# EasyEDA Pro project ProDoc_ESP32_V2_Plant Board_Abed_Double Sided_2025-12-05.epro

# Schematic Board Plant_1

## Sheets
1 Minsys: Board Name: ESP32_V2_Plant Board_Abed_Double Sided; Create Date: 2025-10-20; Page Name: Minsys; Project Name: Pjbl3_2025-2026; Schematic Name: Board Plant_1; Update Date: 2025-11-06; Company: EasyEDA.com; Page Size: A4; Version: V1.0
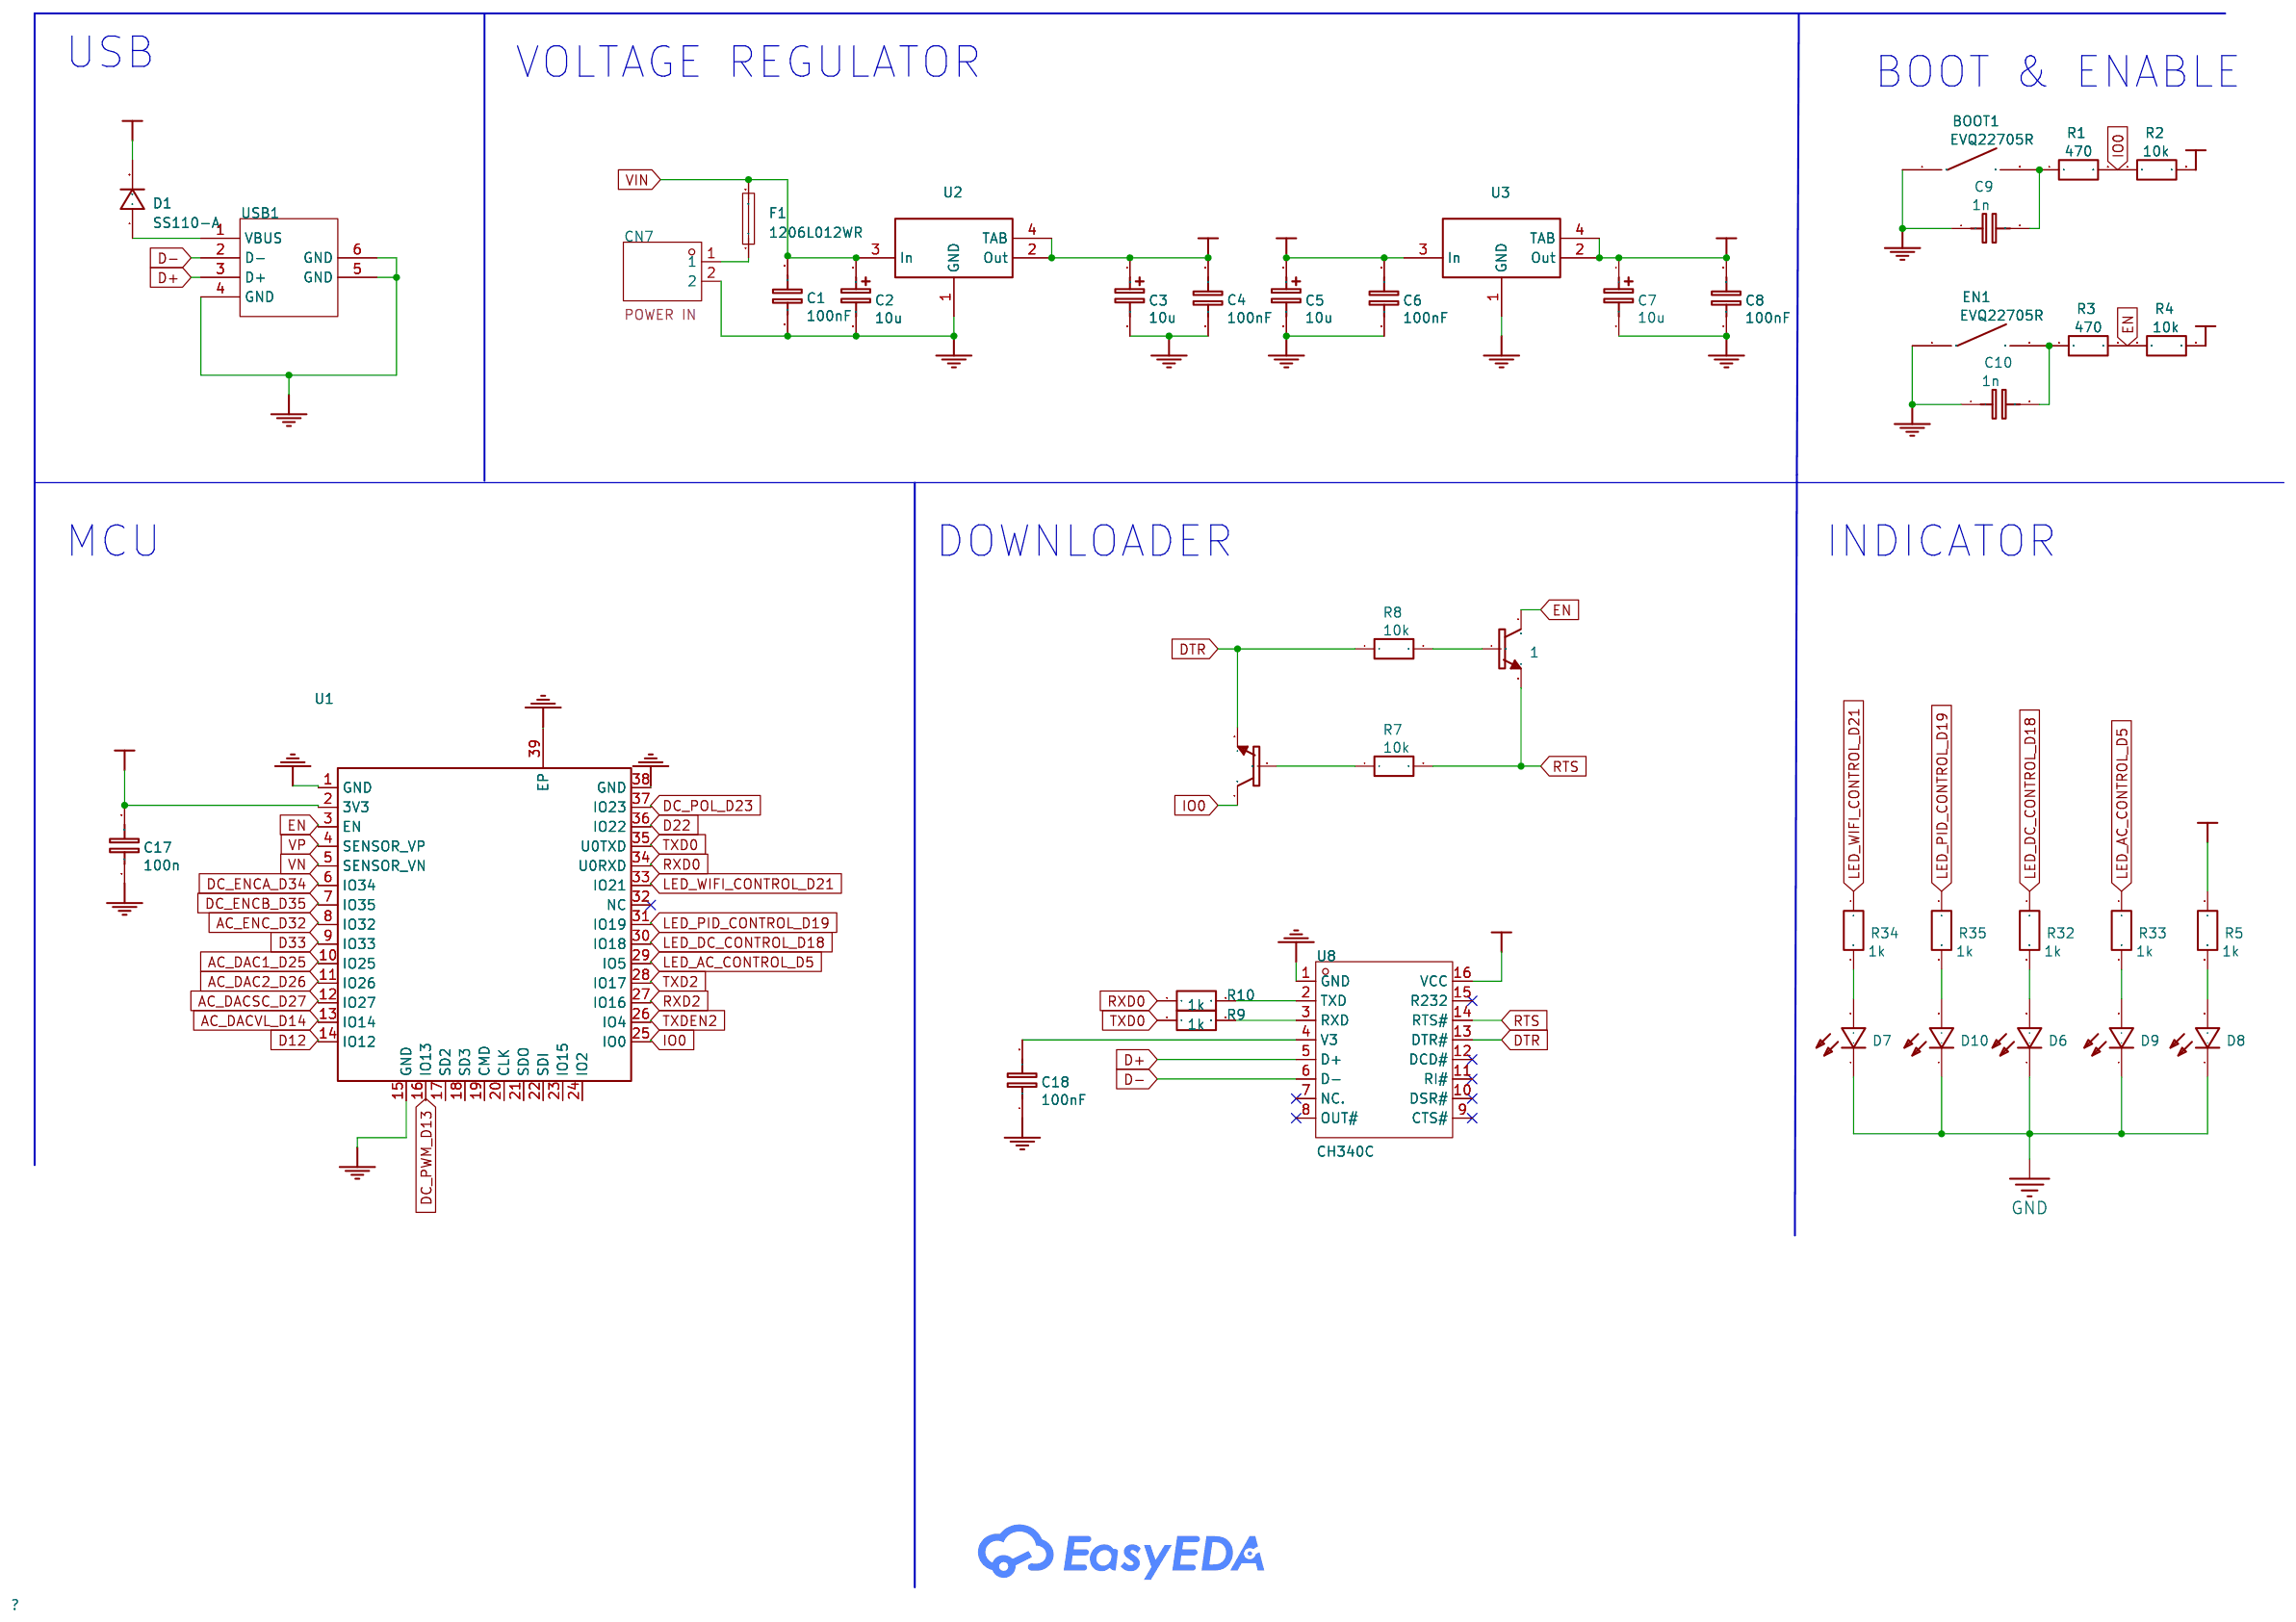
[diagram p0: Minsys]
2 DC Motor Control: Page Name: DC Motor Control; Company: Pjbl-3 2025/2026; Drawn: Pjbl 3-8
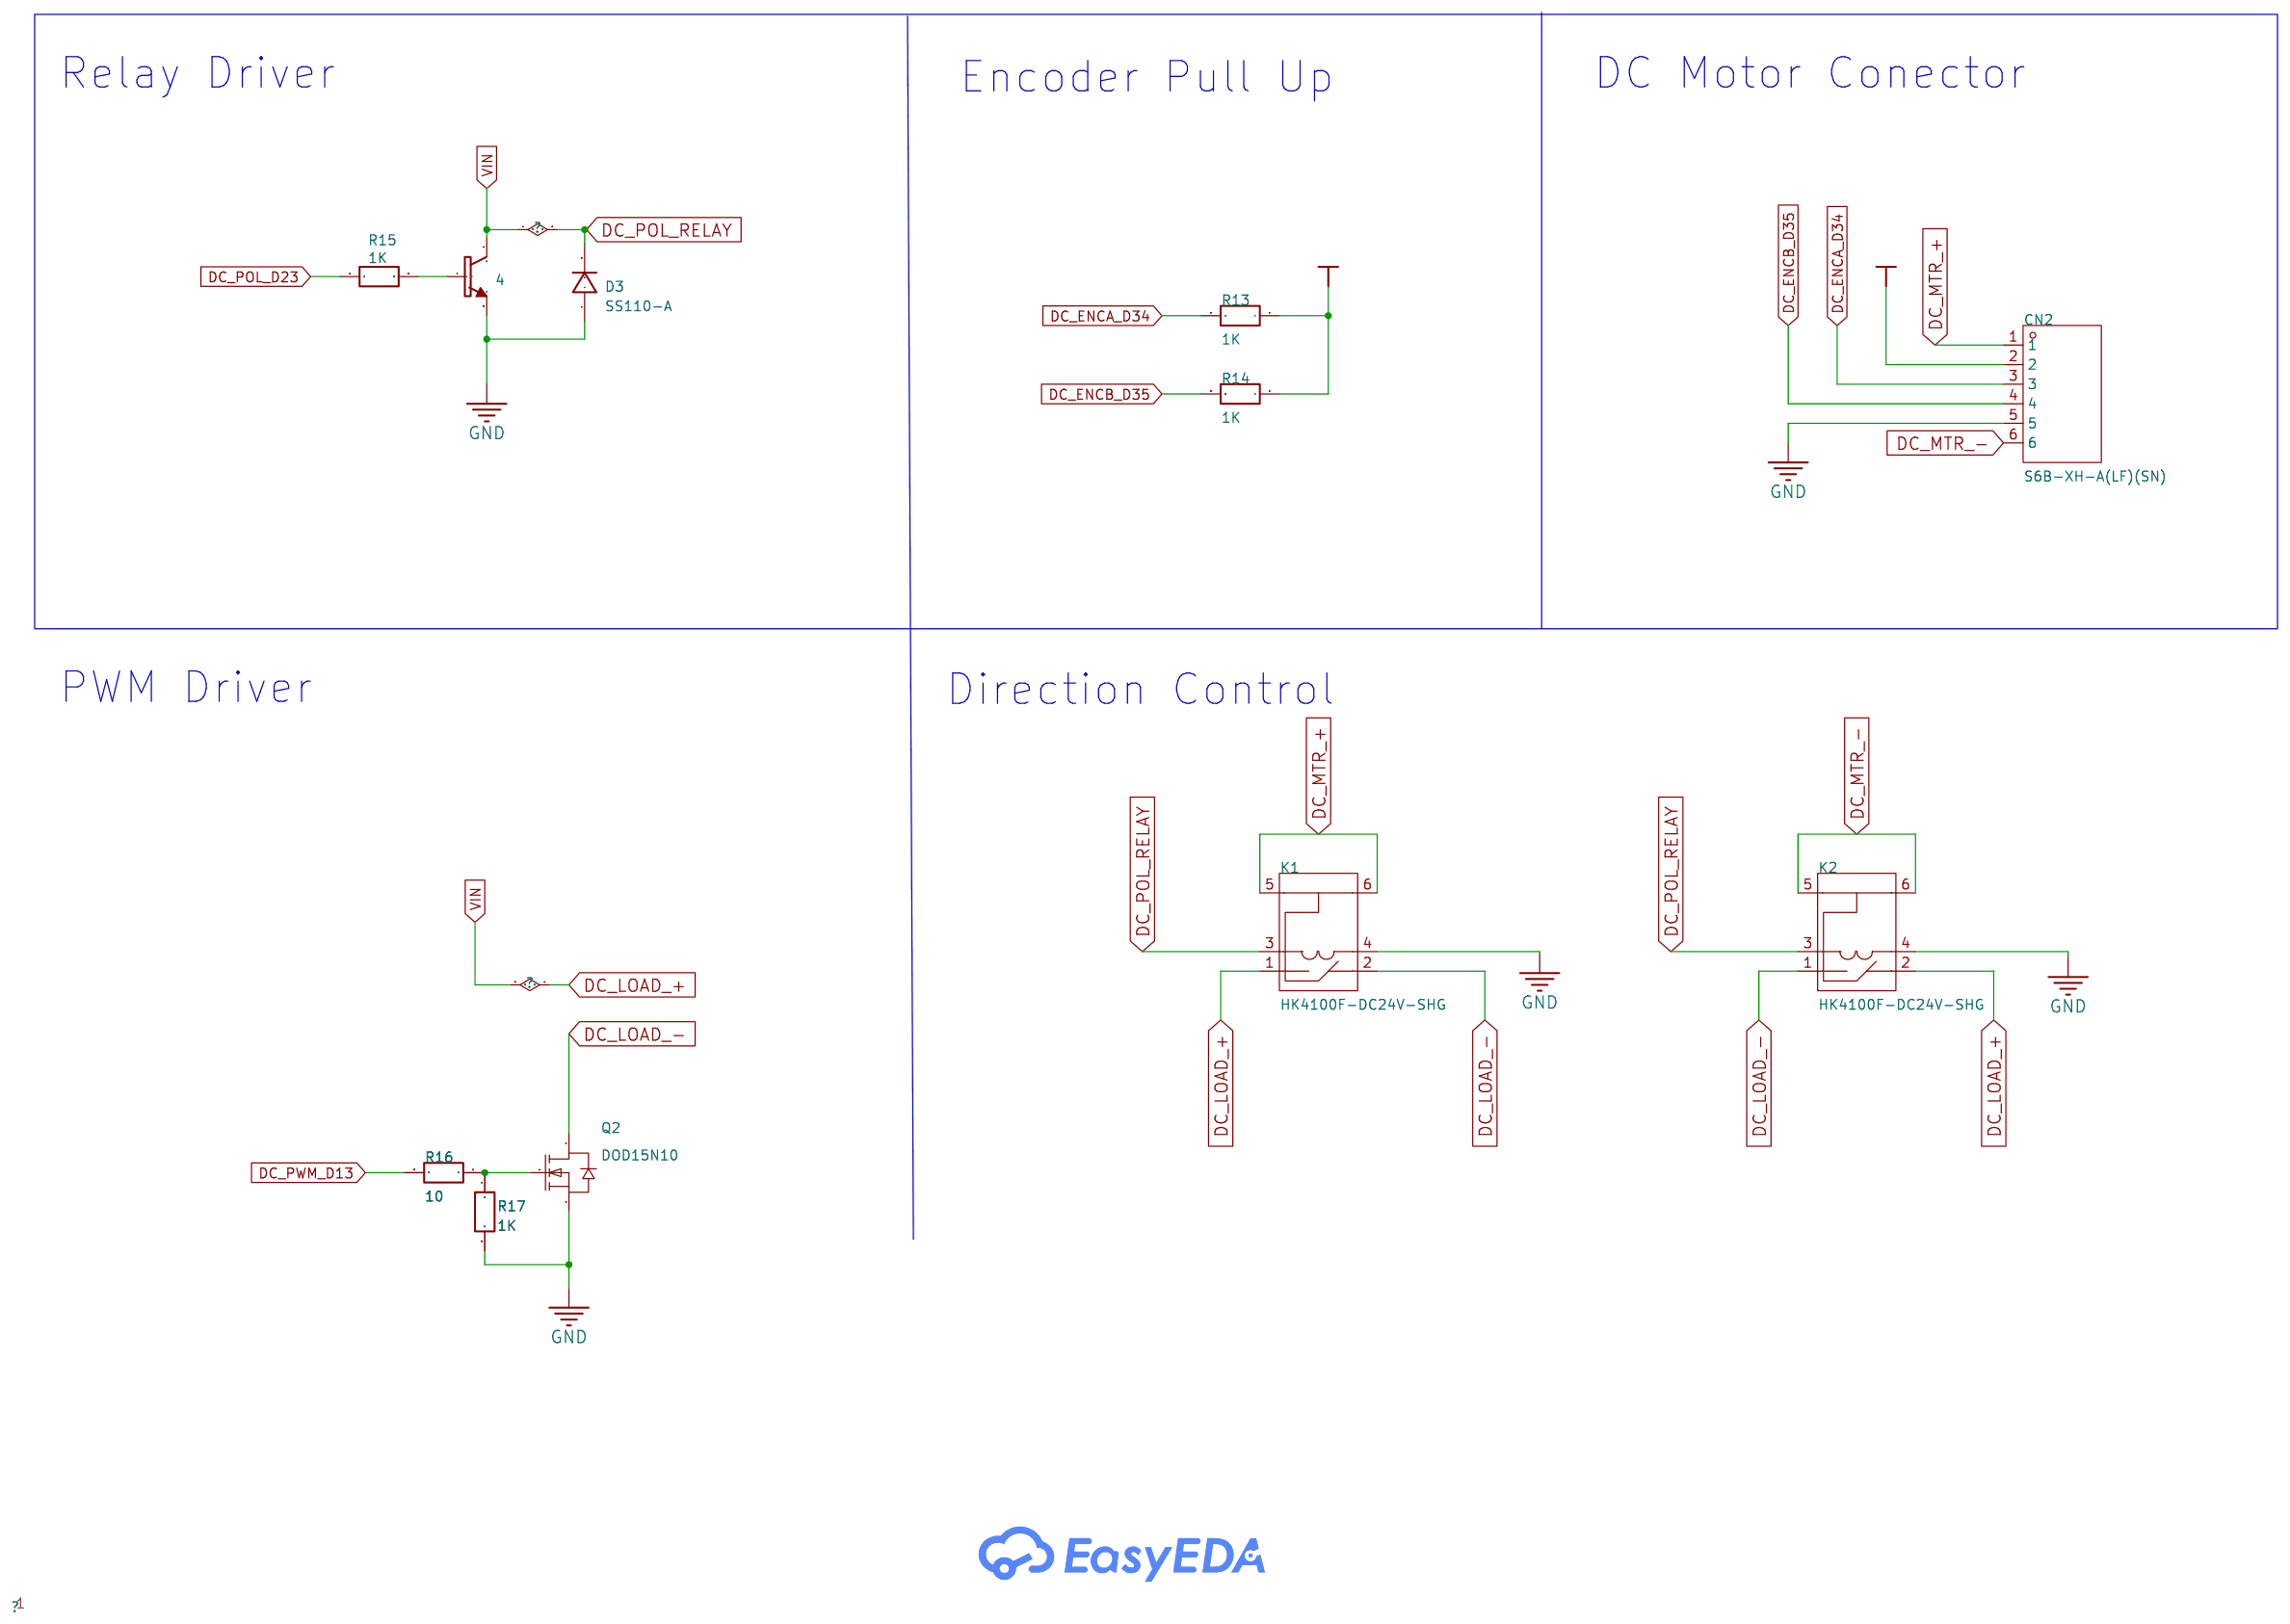
[diagram p1: DC Motor Control]
3 AC Motor Control: Page Name: AC Motor Control
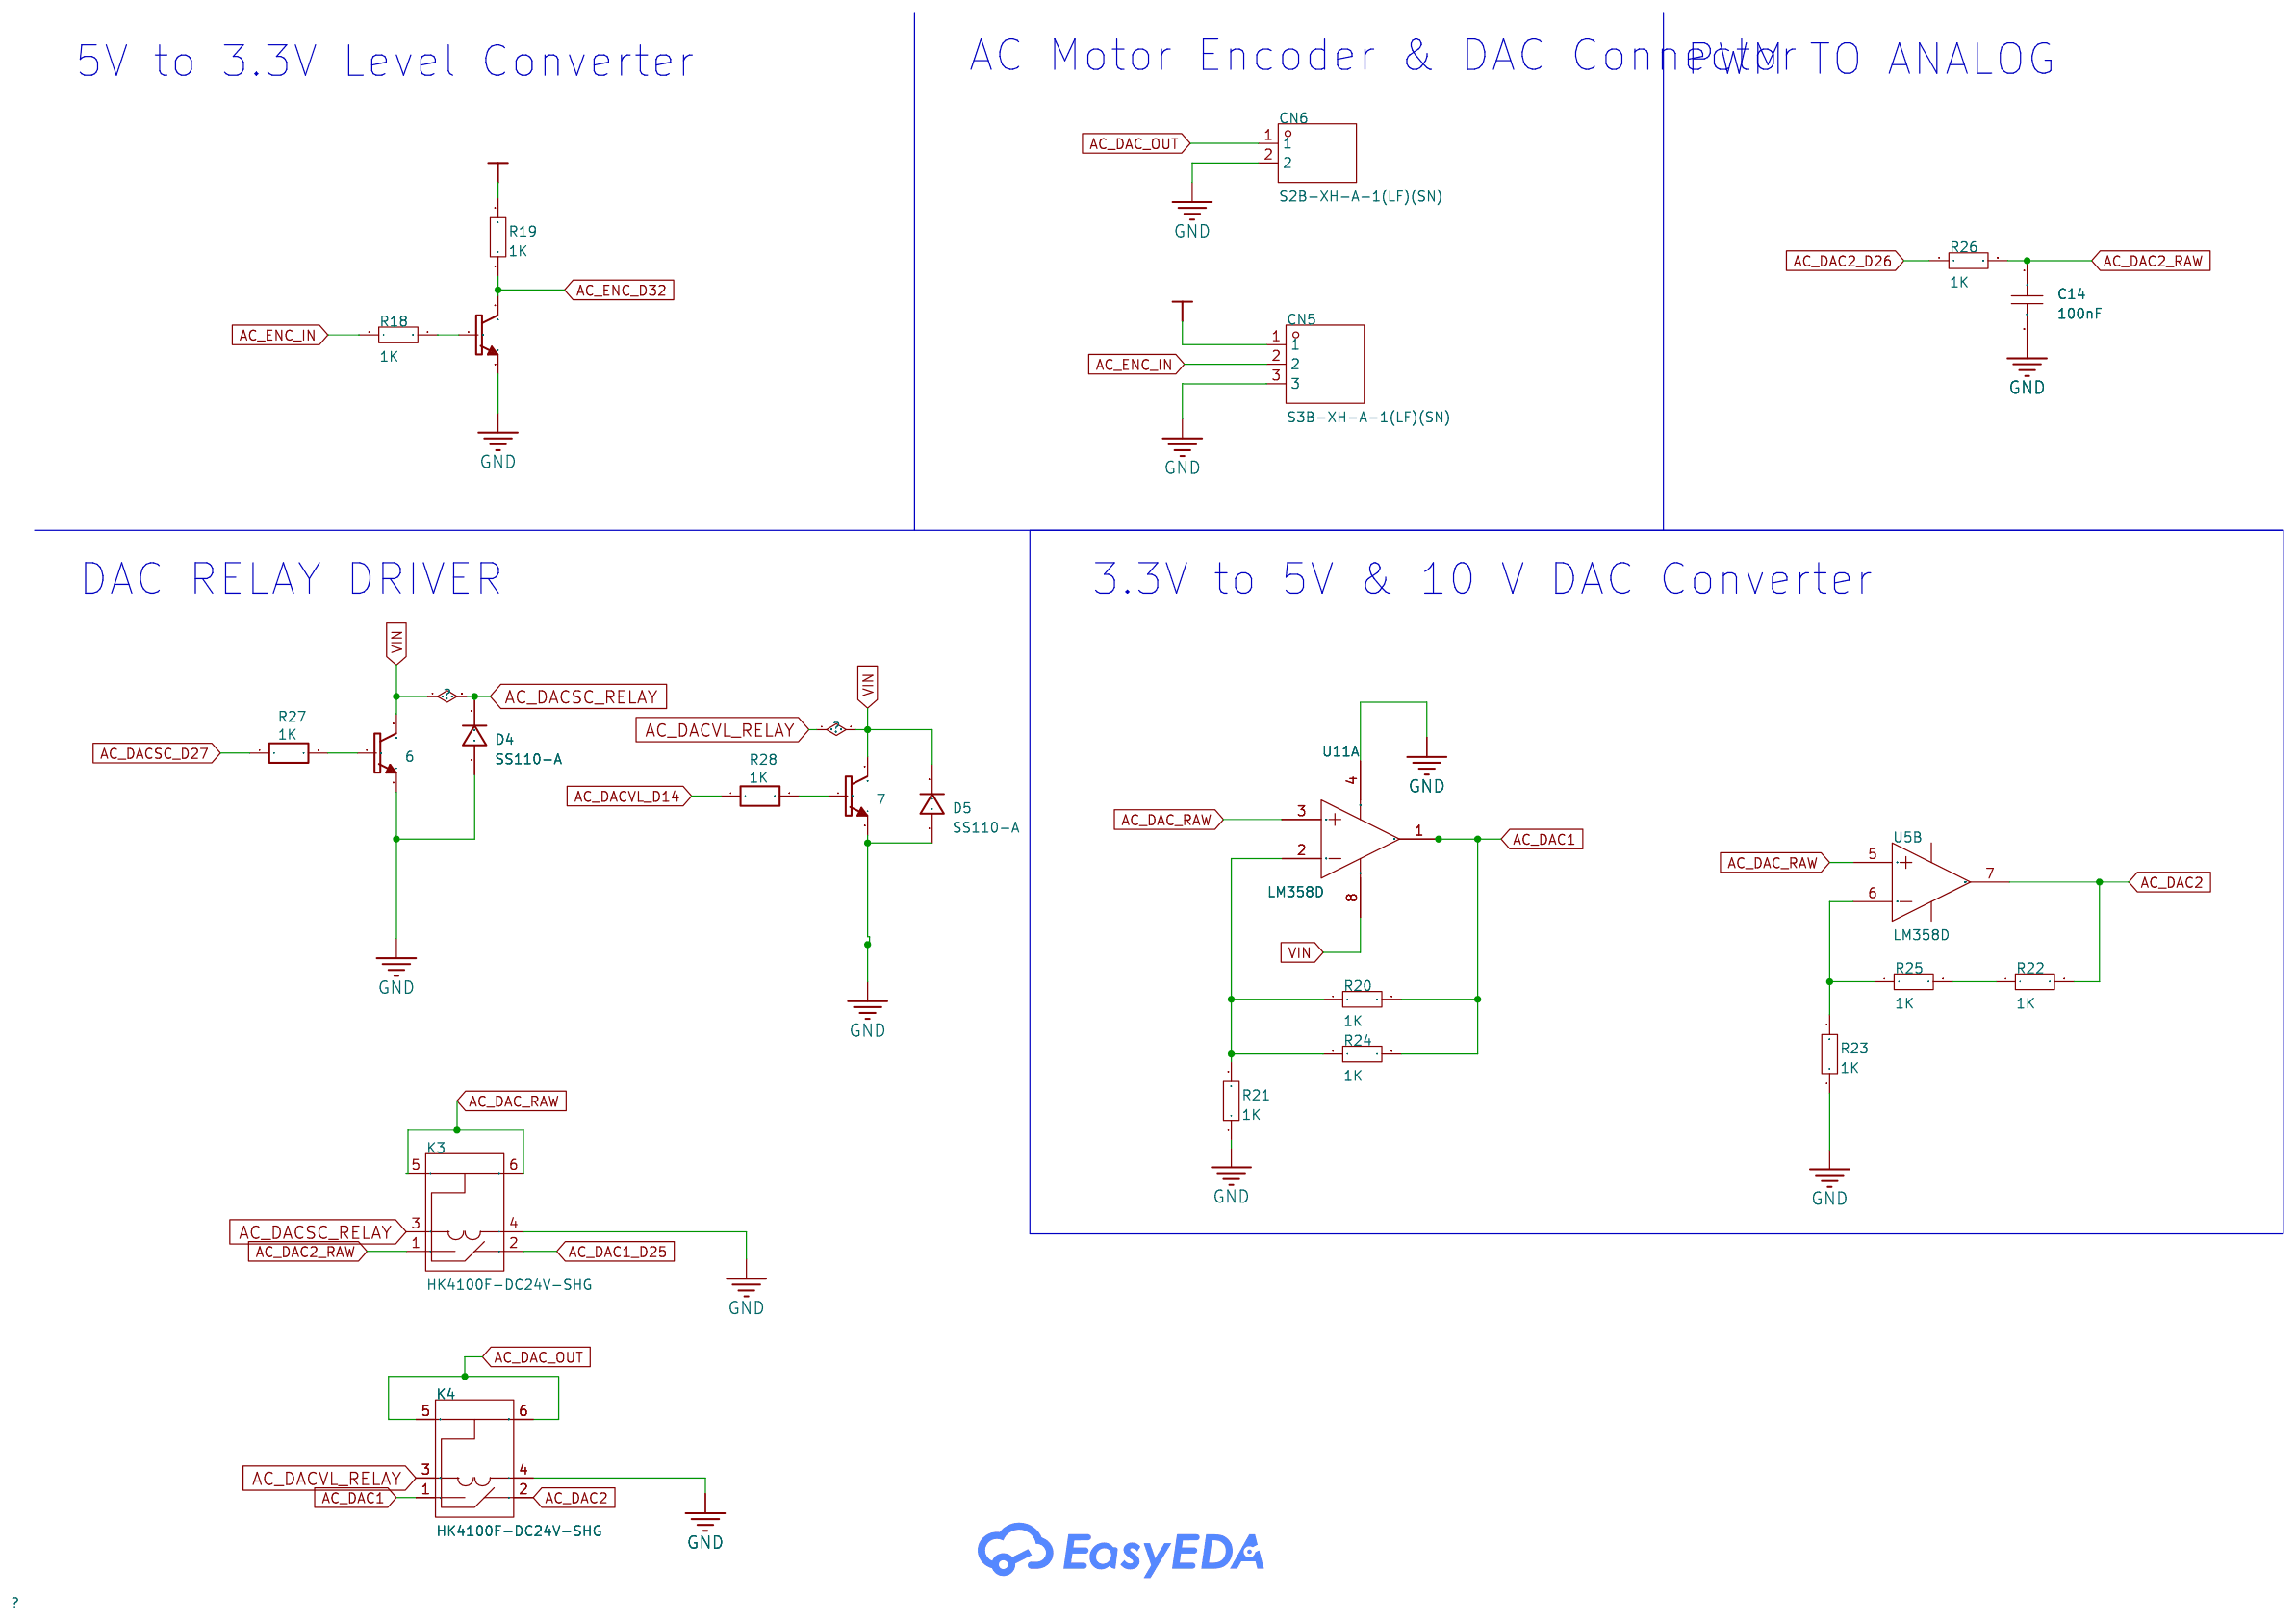
[diagram p2: AC Motor Control]
4 AC Motor Contro RS485: Page Name: AC Motor Contro RS485; Update Date: 2025-10-21
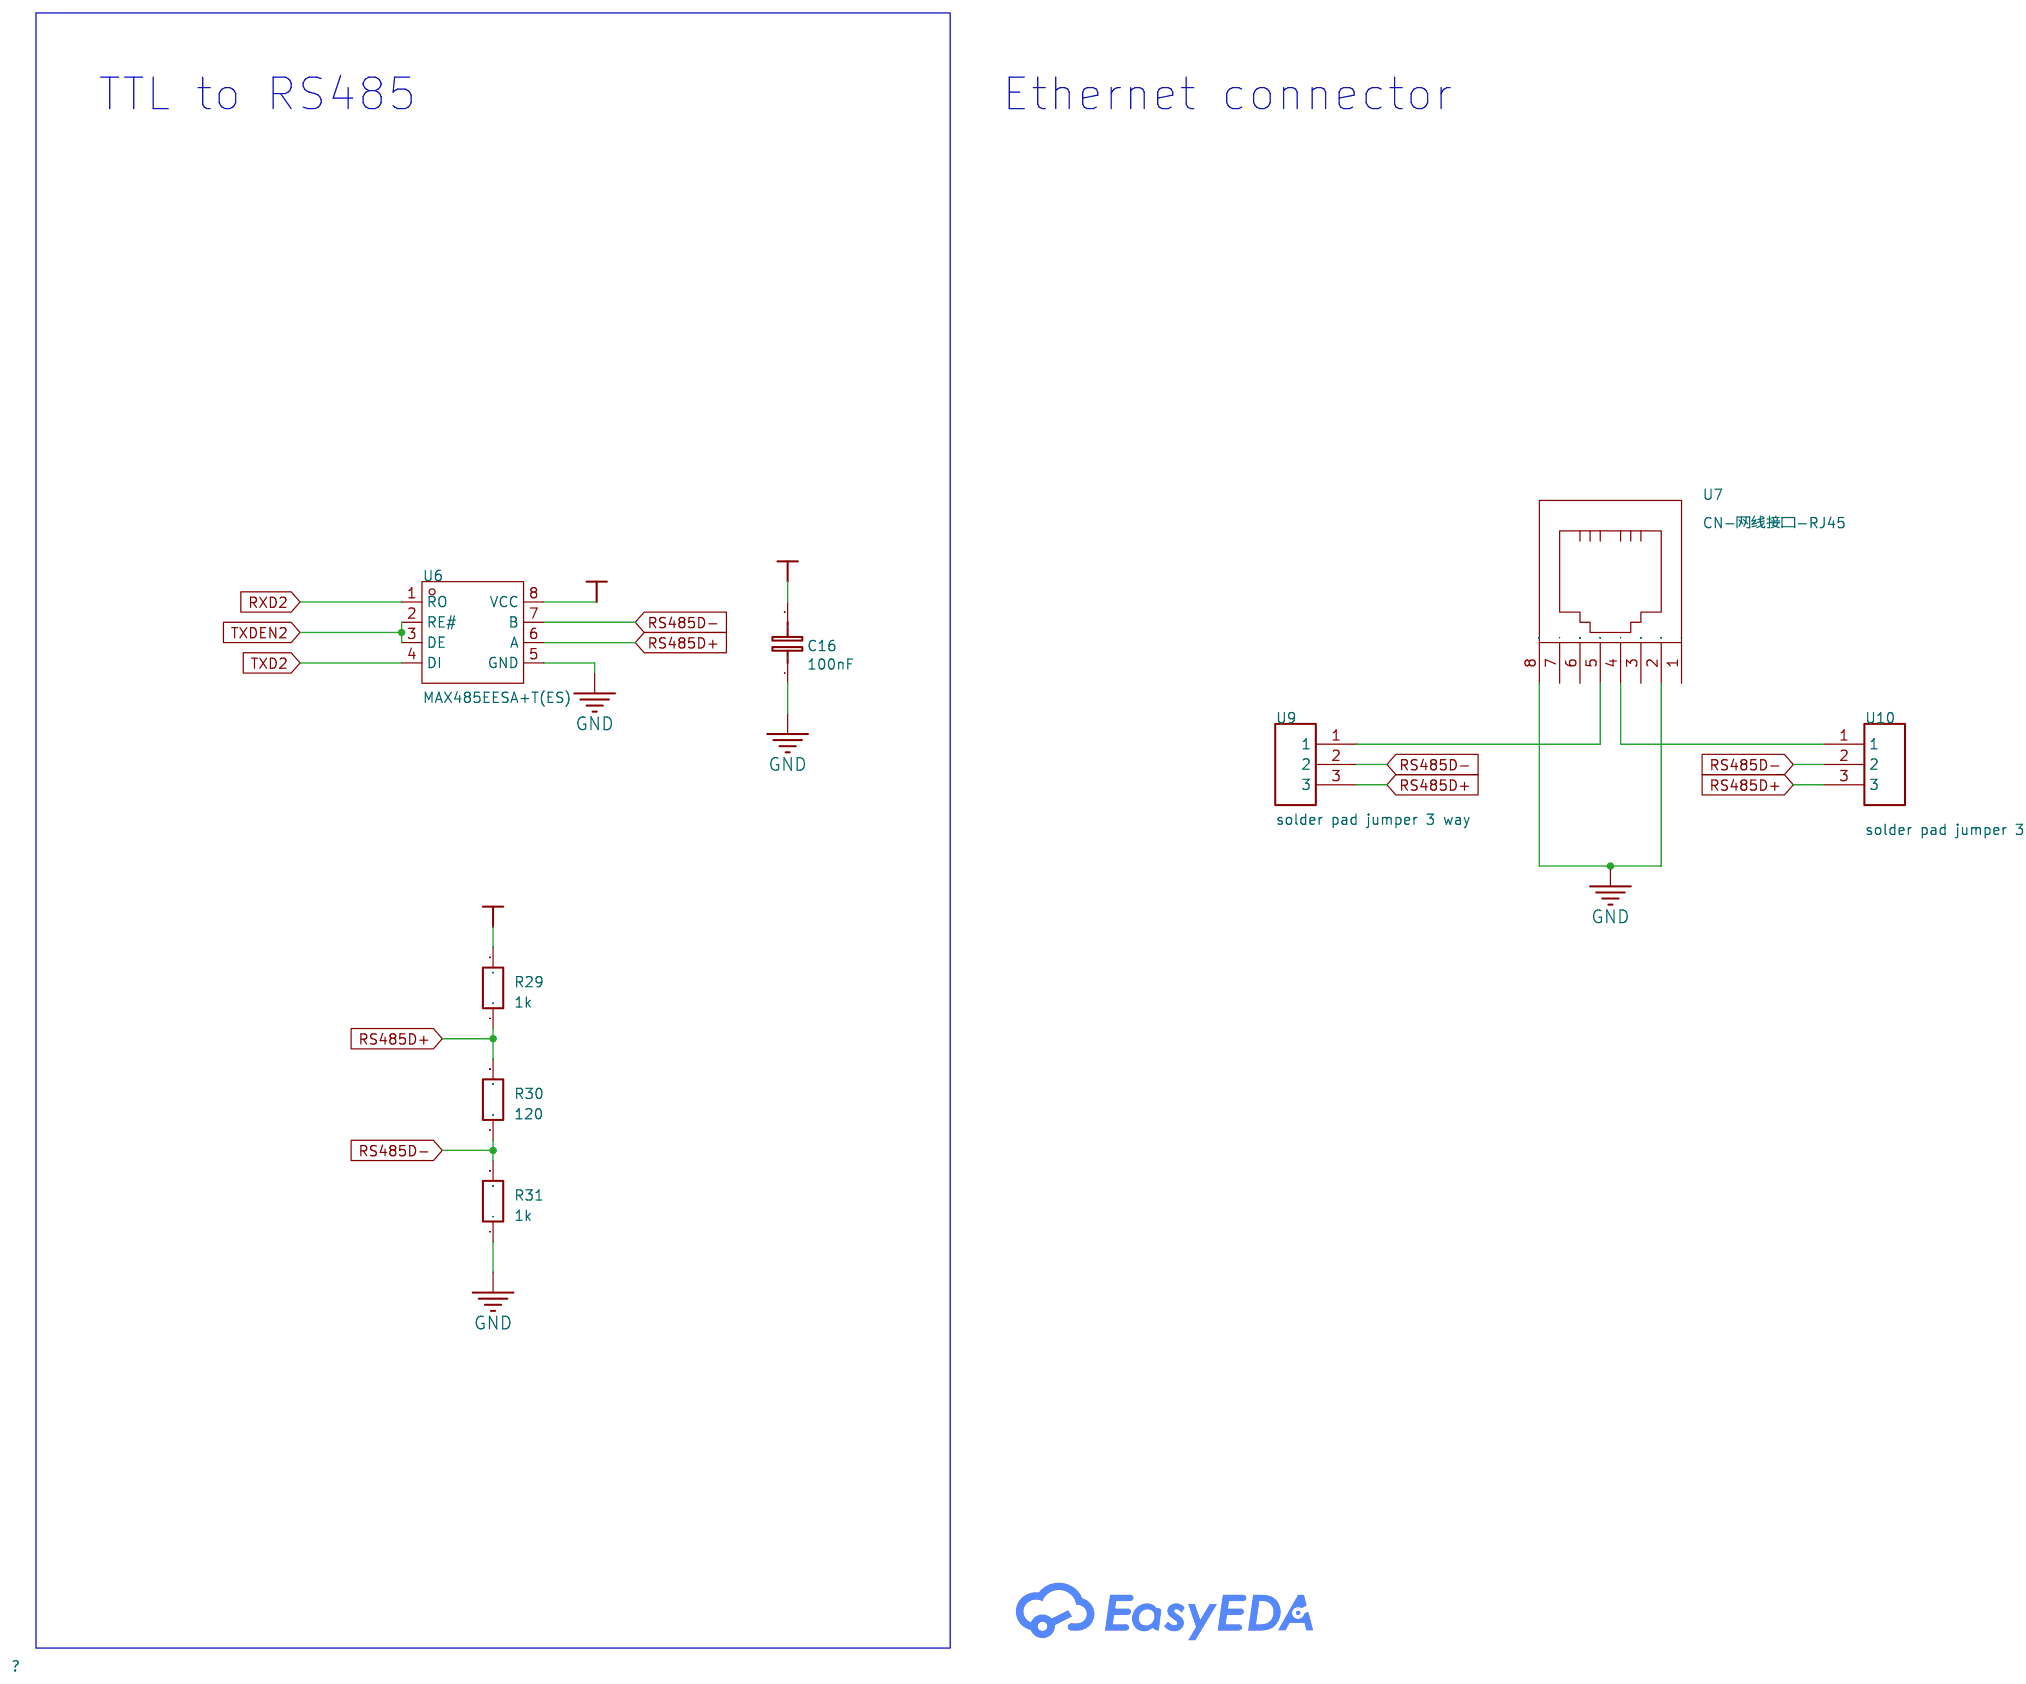
[diagram p3: AC Motor Contro RS485]

## Parts
sheet AC Motor Contro RS485
C16  100nF  [C0603]
R29  1k  [R0603]
R30  120  [R0603]
R31  1k  [R0603]
U6  MAX485EESA+T(ES)  [SOP-8_L4.9-W3.9-P1.27-LS6.0-BL]
U7  CN-网线接口-RJ45  [RJ45-TH_C9900024731]
U9  solder pad jumper 3 way  [SMD JUMPER 3 PIN]
U10  solder pad jumper 3 way  [SMD JUMPER 3 PIN]
sheet AC Motor Control
5  MMBT3904  [SOT-23-3_L2.9-W1.3-P1.90-LS2.4-BR]
6  MMBT3904  [SOT-23-3_L2.9-W1.3-P1.90-LS2.4-BR]
7  MMBT3904  [SOT-23-3_L2.9-W1.3-P1.90-LS2.4-BR]
C14  100nF  [C0603]
CN5  S3B-XH-A-1(LF)(SN)  [CONN-TH_S3B-XH-A-1-LF-SN]
CN6  S2B-XH-A-1(LF)(SN)  [CONN-TH_S2B-XH-A-1-LF-SN]
D4  SS110-A  [D0805]
D5  SS110-A  [D0805]
K3  HK4100F-DC24V-SHG  [RELAY-TH_HK4100F-XXX-XXXX]
K4  HK4100F-DC24V-SHG  [RELAY-TH_HK4100F-XXX-XXXX]
R18  1K  [R0603]
R19  1K  [R0603]
R20  1K  [R0603]
R21  1K  [R0603]
R22  1K  [R0603]
R23  1K  [R0603]
R24  1K  [R0603]
R25  1K  [R0603]
R26  1K  [R0603]
R27  1K  [R0603]
R28  1K  [R0603]
U5  LM358D  [SO-8_L4.9-W3.9-P1.27-LS5.9-BL]  (section 2)
U11  LM358D  [SO-8_L4.9-W3.9-P1.27-LS5.9-BL]  (section 1)
sheet DC Motor Control
4  MMBT3904  [SOT-23-3_L2.9-W1.3-P1.90-LS2.4-BR]
CN2  S6B-XH-A(LF)(SN)  [CONN-TH_S6B-XH-A-LF-SN]
D3  SS110-A  [D0805]
K1  HK4100F-DC24V-SHG  [RELAY-TH_HK4100F-XXX-XXXX]
K2  HK4100F-DC24V-SHG  [RELAY-TH_HK4100F-XXX-XXXX]
Q2  DOD15N10  [TO-252-2_L6.6-W6.1-P4.57-LS9.9-BR-CW]
R13  1K  [R0603]
R14  1K  [R0603]
R15  1K  [R0603]
R16  10  [R0603]
R17  1K  [R0603]
sheet Minsys
1  MMBT3904  [SOT-23-3_L2.9-W1.3-P1.90-LS2.4-BR]
2  MMBT3904  [SOT-23-3_L2.9-W1.3-P1.90-LS2.4-BR]
BOOT1  EVQ22705R  [SMD_PUSH]
C1  100nF  [C0603]
C2  10u  [CASE-A_3216]
C3  10u  [CASE-A_3216]
C4  100nF  [C0603]
C5  10u  [CASE-A_3216]
C6  100nF  [C0603]
C7  10u  [CASE-A_3216]
C8  100nF  [C0603]
C9  1n  [C0603]
C10  1n  [C0603]
C17  100n  [C0603]
C18  100nF  [C0603]
CN7  S2B-XH-A-1(LF)(SN)  [CONN-TH_S2B-XH-A-1-LF-SN]
D1  SS110-A  [D0805]
D6  17-21/BHC-XL2M2TY/3T  [LED0805-RD_BLUE]
D7  17-21/BHC-XL2M2TY/3T  [LED0805-RD_BLUE]
D8  17-21/BHC-XL2M2TY/3T  [LED0805-RD_BLUE]
D9  17-21/BHC-XL2M2TY/3T  [LED0805-RD_BLUE]
D10  17-21/BHC-XL2M2TY/3T  [LED0805-RD_BLUE]
EN1  EVQ22705R  [SMD_PUSH]
F1  1206L012WR  [F1206]
R1  470  [R0603]
R2  10k  [R0603]
R3  470  [R0603]
R4  10k  [R0603]
R5  1k  [R0603]
R7  10k  [R0603]
R8  10k  [R0603]
R9  1k  [R0603]
R10  1k  [R0603]
R32  1k  [R0603]
R33  1k  [R0603]
R34  1k  [R0603]
R35  1k  [R0603]
U1  ESP32-WROOM-32D-N8  [WIFIM-SMD_39P-L25.5-W18.0-P1.27]
U2  AMS1117-5.0  [SOT-223_L6.7-W3.5-P2.30-BR]
U3  AMS1117-3.3  [SOT-223-3_L6.5-W3.4-P2.30-LS7.0-BR]
U8  CH340C  [SOP-16_L10.0-W3.9-P1.27-LS6.0-BL]
USB1  USB-B01  [USB-B-TH_USB-B01]

## Library data of the parts
C1 C16 = MBK0805X7R104K500NT: Capacitance:100nF Voltage Rating:50V Temperature Coefficient:-; LCSC Part Name: 100nF 50V; Supplier Part: C2830721; Manufacturer: FH-BK(风华邦科); Supplier Footprint: 0805; JLCPCB Part Class: Extended Part; Datasheet: https://item.szlcsc.com/datasheet/MBK0805X7R104K500NT/2982800.html; Supplier: LCSC; Voltage Rating: 50V
R9 R10 R29-R31 = 1k: nameAlias: Value(Ω); Contributor: LCEDA_Lib; spicePre: R; spiceSymbolName: R_AXIAL-0.5_EU
U6 = MAX485EESA+T(ES): Types:Transceiver Number of Driver:1 Number of receiver:1 Supply Voltage:4.5V~5.5V Supply Voltage:4.5V~5.5V Data Rate:2.5Mbps Data Rate:2.5Mbps Node Number:256 ESD Protect:±15kV ESD Protect:±15kV Operating Temperature:-40℃~+125℃ Operating Temperature:-40℃; LCSC Part Name: MAX485EESA+T RS-485/RS422收发器; Supplier Part: C41438291; Manufacturer: ElecSuper(静芯微); Supplier Footprint: SOP-8; Datasheet: https://atta.szlcsc.com/upload/public/pdf/source/20241021/BE871474122F591137C5367E5564A964.pdf; Supplier: LCSC; Types: Transceiver; Number of Driver: 1; Number of receiver: 1; Supply Voltage: 4.5V~5.5V; Data Rate: 2.5Mbps; Node Number: 256; ESD Protect: ±15kV; Operating Temperature: -40℃~+125℃
U7 = CN-网线接口-RJ45: Supplier Part: C9900024731; Supplier Footprint: RJ45; JLCPCB Part Class: Extended Part; Supplier: LCSC
U9 U10 = solder pad jumper 3 way
1 2 4-7 = MMBT3904_C18195365: type:NPN Current - Collector(Ic):200mA Collector - Emitter Voltage VCEO:40V Pd - Power Dissipation:200mW Transition frequency(fT):300MHz Current - Collector Cutoff:100nA Vce Saturation(VCE(sat)):300mV@50mA,5mA Emitter-Base Voltage(Vebo):6V Number:1 NPN; LCSC Part Name: NPN 电流:0.2A 电压:40V; Supplier Part: C18195365; Manufacturer: LJ(朗捷); Supplier Footprint: SOT-23; JLCPCB Part Class: Extended Part; Datasheet: https://item.szlcsc.com/datasheet/MMBT3904/19344752.html; Supplier: LCSC; type: NPN; Current - Collector(Ic): 200mA; Collector - Emitter Voltage VCEO: 40V; Pd - Power Dissipation: 200mW; Transition frequency(fT): 300MHz; Current - Collector Cutoff: 100nA; Vce Saturation(VCE(sat)): 300mV@50mA,5mA; Emitter-Base Voltage(Vebo): 6V; Number: 1 NPN
C14 = CAP_0603: Supplier Footprint: 0603
CN5 = S3B-XH-A-1(LF)(SN): Pins Structure:1x3P Pitch:2.5mm Mounting Type:Right Angle Reference Series:XH Number of Pins:3P Number of Rows:1 Number of PINs Per Row:3 Row Spacing:- Current Rating:3A Contact Material:Brass Contact Plating:Tin Operating Temperature:-25℃~+85℃ Operating; LCSC Part Name: 1x3P 间距:2.5mm 弯插 系列:XH; Supplier Part: C163036; Manufacturer: JST; Supplier Footprint: 弯插,P=2.5mm; JLCPCB Part Class: Extended Part; Datasheet: https://item.szlcsc.com/datasheet/S3B-XH-A-1(LF)(SN)/174417.html; Supplier: LCSC; Pins Structure: 1x3P; Pitch: 2.5mm; Mounting Type: Right Angle; Reference Series: XH; Number of Pins: 3P; Number of Rows: 1; Number of PINs Per Row: 3; Current Rating: 3A; Contact Material: Brass; Contact Plating: Tin; Operating Temperature: -25℃~+85℃; Voltage Rating: 250V; Plastic Material: PA66; Flame Retardant Rating: UL94V-0; Supplementary Features: K Pin; Color: White; Z-Height of the Board: 6.1mm; X-Length of Bottom Edge on Board (Spacing Line): 9.9mm; Y-Width of Bottom Edge on Board: 11.5mm
CN6 = S2B-XH-A-1(LF)(SN): Pins Structure:1x2P Pitch:2.5mm Mounting Type:Right Angle Reference Series:XH Number of Pins:2P Number of Rows:1 Number of PINs Per Row:2 Row Spacing:- Current Rating:3A Contact Material:Brass Contact Plating:Tin Operating Temperature:-25℃~+85℃ Operating; LCSC Part Name: 1x2P 间距:2.5mm 弯插 系列:XH; Supplier Part: C163035; Manufacturer: JST; Supplier Footprint: 弯插,P=2.5mm; JLCPCB Part Class: Extended Part; Datasheet: https://item.szlcsc.com/datasheet/S2B-XH-A-1(LF)(SN)/174416.html; Supplier: LCSC; Pins Structure: 1x2P; Pitch: 2.5mm; Mounting Type: Right Angle; Reference Series: XH; Number of Pins: 2P; Number of Rows: 1; Number of PINs Per Row: 2; Current Rating: 3A; Contact Material: Brass; Contact Plating: Tin; Operating Temperature: -25℃~+85℃; Voltage Rating: 250V; Plastic Material: PA66; Flame Retardant Rating: UL94V-0; Supplementary Features: K Pin; Color: White; Z-Height of the Board: 6.1mm; X-Length of Bottom Edge on Board (Spacing Line): 7.4mm; Y-Width of Bottom Edge on Board: 11.5mm
D1 D3-D5 = SS110-A: Supplier Part: C143192; Supplier: LCSC; Manufacturer: FMS; Contributor: LCSC; spicePre: D
K1-K4 = HK4100F-DC24V-SHG: Coil Voltage:- Contact Form:- Number of Pins:- Contact Rating:- Switching Voltage(Max):- Contact Material:- Switching Current(Max):- Coil Type:- Coil Resistance:- Contact Resistance:- Operate Time:- Release Time:- Operating Temperature:- Operating Tempera; Supplier Part: C38031; Manufacturer: 汇科; Supplier Footprint: DIP,14.5x10.5mm; JLCPCB Part Class: Extended Part; Datasheet: https://item.szlcsc.com/datasheet/HK4100F-DC24V-SHG/39012.html; Supplier: LCSC
R18-R26 = Res_0603: Supplier Footprint: 0603
R2 R4 R7 R8 R13-R17 R27 R28 = 10k: nameAlias: Value(Ω); spicePre: R; spiceSymbolName: Res_0805(1/8W)_EU
U5 U11 = LM358D: Number of Channels:2 Maximum Power Supply Range (Vdd-Vss):32V Rail to Rail:- Gain Bandwidth Product:- Vos - Input Offset Voltage:7mV Input Offset Voltage Drift(Vos TC):30uV/℃ Slew Rate:600V/ms Ib - Input Bias Current:200nA Input Offset Current(Ios):- Nois; LCSC Part Name: 低功耗双运算放大器，低输入偏置电流; Supplier Part: C2936099; Manufacturer: ST(意法半导体); Supplier Footprint: SO-8; Datasheet: https://item.szlcsc.com/datasheet/LM358D/3287847.html; Supplier: LCSC; Number of Channels: 2; Maximum Power Supply Range (Vdd-Vss): 32V; Vos - Input Offset Voltage: 7mV; Input Offset Voltage Drift(Vos TC): 30uV/℃; Slew Rate: 600V/ms; Ib - Input Bias Current: 200nA; Noise density(eN): 55nV/√Hz@1kHz; Common Mode Rejection Ratio(CMRR): 85dB; Operating Temperature: 0℃~+70℃; Single supply: 3V~30V
CN2 = S6B-XH-A(LF)(SN): Pins Structure:1x6P Pitch:2.5mm Mounting Type:Right Angle Reference Series:XH Number of Pins:6P Number of Rows:1 Number of PINs Per Row:6 Row Spacing:- Current Rating:3A Contact Material:Brass Contact Plating:Tin Operating Temperature:-25℃~+85℃ Operating; LCSC Part Name: 1x6P 间距:2.5mm 弯插 系列:XH; Supplier Part: C157919; Manufacturer: JST; Supplier Footprint: 弯插,P=2.5mm; JLCPCB Part Class: Extended Part; Datasheet: https://item.szlcsc.com/datasheet/S6B-XH-A(LF)(SN)/169267.html; Supplier: LCSC; Pins Structure: 1x6P; Pitch: 2.5mm; Mounting Type: Right Angle; Reference Series: XH; Number of Pins: 6P; Number of Rows: 1; Number of PINs Per Row: 6; Current Rating: 3A; Contact Material: Brass; Contact Plating: Tin; Operating Temperature: -25℃~+85℃; Voltage Rating: 250V; Plastic Material: PA66; Flame Retardant Rating: UL94V-0; Supplementary Features: K Pin; Color: White; Z-Height of the Board: 6.1mm; X-Length of Bottom Edge on Board (Spacing Line): 17.4mm; Y-Width of Bottom Edge on Board: 11.5mm
Q2 = DOD15N10: Number:1 N-Channel Drain to Source Voltage:100V Current - Continuous Drain(Id):15A RDS(on):75mΩ@10V Pd - Power Dissipation:46W Gate Threshold Voltage (Vgs(th)):1.8V@250uA Gate Charge(Qg):6nC@10V Input Capacitance(Ciss):1.083nF Reverse Transfer Capacitance; LCSC Part Name: 1个N沟道 耐压:100V 电流:15A; Supplier Part: C36499175; Manufacturer: DOINGTER(杜因特); Supplier Footprint: TO-252; Datasheet: https://item.szlcsc.com/datasheet/DOD15N10/38221897.html; Supplier: LCSC; Number: 1 N-Channel; Drain to Source Voltage: 100V; Current - Continuous Drain(Id): 15A; RDS(on): 75mΩ@10V; Pd - Power Dissipation: 46W; Gate Threshold Voltage (Vgs(th)): 1.8V@250uA; Gate Charge(Qg): 6nC@10V; Input Capacitance(Ciss): 1.083nF; Reverse Transfer Capacitance (Crss@Vds): 40pF; Operating Temperature: -55℃~+150℃; Type: N-Channel; Output Capacitance(Coss): 51pF
BOOT1 EN1 = EVQ22705R: Supplier: LCSC; Manufacturer: PANASONIC; Supplier Part: C79156; Contributor: LCSC; spicePre: S
C2 C3 = 10u: nameAlias: Value(F); Contributor: LCEDA_Lib; spicePre: C; spiceSymbolName: C_Tan_SMD_A_EU
C4 C17 C18 = 100n: nameAlias: Value(F); Contributor: LCEDA_Lib; spicePre: C; spiceSymbolName: C_0603_EU
C5 C7 = 100u: nameAlias: Value(F); Contributor: LCEDA_Lib; spicePre: C; spiceSymbolName: C_Tan_SMD_A_EU
C6 C8 = 100nF: nameAlias: Value(F); Contributor: LCEDA_Lib; spicePre: C; spiceSymbolName: C_0603_EU
C9 C10 = 1n: nameAlias: Value(F); spicePre: C; spiceSymbolName: Cap_0805_EU
CN7 = S2B-XH-A-1(LF)(SN): POWER IN; LCSC Part Name: 1x2P 间距:2.5mm 弯插 系列:XH; Supplier Part: C163035; Manufacturer: JST; Supplier Footprint: 弯插,P=2.5mm; JLCPCB Part Class: Extended Part; Datasheet: https://item.szlcsc.com/datasheet/S2B-XH-A-1(LF)(SN)/174416.html; Supplier: LCSC; Pins Structure: 1x2P; Pitch: 2.5mm; Mounting Type: Right Angle; Reference Series: XH; Number of Pins: 2P; Number of Rows: 1; Number of PINs Per Row: 2; Current Rating: 3A; Contact Material: Brass; Contact Plating: Tin; Operating Temperature: -25℃~+85℃; Voltage Rating: 250V; Plastic Material: PA66; Flame Retardant Rating: UL94V-0; Supplementary Features: K Pin; Color: White; Z-Height of the Board: 6.1mm; X-Length of Bottom Edge on Board (Spacing Line): 7.4mm; Y-Width of Bottom Edge on Board: 11.5mm
D6-D10 = 17-21/BHC-XL2M2TY/3T: Supplier: LCSC; Manufacturer: EVERLIGHT; image: //image.lceda.cn/szlcsc/C72035.jpg; Supplier Part: C72035; JLCPCB Part Class: Extend; LCSC Assembly: Yes; spicePre: L
F1 = 1206L012WR: Voltage - Max:30V Current - Max:100A Hold Current:125mA Trip Current:290mA Power Dissipation:- Resistance - Initial (Ri) (Min):1.5Ω Resistance - Post Trip (R1) (Max):6Ω Time to Trip(Max):200ms Operating Temperature:-40℃~+85℃ Operating Temperature:-40℃~+85; LCSC Part Name: 30V 125mA 1206自恢复; Supplier Part: C151160; Manufacturer: Littelfuse(美国力特); Supplier Footprint: 1206; Datasheet: https://item.szlcsc.com/datasheet/1206L012WR/162500.html; Supplier: LCSC; Voltage - Max: 30V; Current - Max: 100A; Hold Current: 125mA; Trip Current: 290mA; Resistance - Initial (Ri) (Min): 1.5Ω; Resistance - Post Trip (R1) (Max): 6Ω; Time to Trip(Max): 200ms; Operating Temperature: -40℃~+85℃
R1 R3 = 470: nameAlias: Value(Ω); spicePre: R; spiceSymbolName: Res_0805(1/8W)_EU
R5 R32-R35 = 1k: nameAlias: Value(Ω); spicePre: R; spiceSymbolName: Res_0805(1/8W)_EU
U1 = ESP32-WROOM-32D-N8: LCSC Part Name: 通用型Wi-Fi+BT+BLE MCU模组; Supplier Part: C529577; Manufacturer: ESPRESSIF(乐鑫); Supplier Footprint: SMD,25.5x18mm; JLCPCB Part Class: Extended Part; Datasheet: https://item.szlcsc.com/datasheet/ESP32-WROOM-32D-N8/549843.html; Supplier: LCSC
U2 = AMS1117-5.0_C347223: Output Type:Fixed Maximum Input Voltage:18V Output Voltage:5V Output Voltage:5V Output Current:1A Power Supply Rejection Ratio (PSRR):60dB@(120Hz) Dropout Voltage:1.3V@(1A) standby current:- Noise:- Feature:Overcurrent Protection(OCP) Operating Temperatur; LCSC Part Name: 输出:5V 电流:1A 耐压:12V; Supplier Part: C347223; Manufacturer: UMW(友台半导体); Supplier Footprint: SOT-223; JLCPCB Part Class: Extended Part; Datasheet: https://atta.szlcsc.com/upload/public/pdf/source/20241218/BAF0263FA2E44BCD8AF41AA4FA04EFAA.pdf; Supplier: LCSC; Output Type: Fixed; Maximum Input Voltage: 18V; Output Voltage: 5V; Output Current: 1A; Power Supply Rejection Ratio (PSRR): 60dB@(120Hz); Dropout Voltage: 1.3V@(1A); Feature: Overcurrent Protection(OCP); Output Polarity: Positive electrode; Number of Outputs: 1
U3 = AMS1117-3.3_C18212698: Output Type:Fixed Voltage - Supply:12V Output Voltage:3.3V Output Voltage:3.3V Output Current:1A Power Supply Rejection Ratio (PSRR):- Voltage Dropout:1.3V@(1A) standby current:4mA Noise:- Features:- Operating Temperature:- Operating Temperature:- Output; Supplier Part: C18212698; Manufacturer: TECH PUBLIC(台舟); Supplier Footprint: SOT-223; JLCPCB Part Class: Extended Part; Datasheet: https://item.szlcsc.com/datasheet/AMS1117-3.3/19384486.html; Supplier: LCSC; Output Type: Fixed; Voltage - Supply: 12V; Output Voltage: 3.3V; Output Current: 1A; Voltage Dropout: 1.3V@(1A); standby current: 4mA; Output Configuration: Positive; Number of Outputs: 1
U8 = CH340C: Applications Function:Transceiver USB Protocol:USB 2.0 Voltage - Supply:3.3V；5V Voltage - Supply:3.3V；5V Data Rate:2Mbps Operating Temperature:-20℃~+70℃ Operating Temperature:-20℃~+70℃ Current - Supply:7mA Supply Current (Iq):50uA; LCSC Part Name: USB转串口芯片; Supplier Part: C84681; Manufacturer: WCH(南京沁恒); Supplier Footprint: SOP-16; Datasheet: https://item.szlcsc.com/datasheet/CH340C/85852.html; Supplier: LCSC; Applications Function: Transceiver; USB Protocol: USB 2.0; Voltage - Supply: 3.3V；5V; Data Rate: 2Mbps; Operating Temperature: -20℃~+70℃; Current - Supply: 7mA; Supply Current (Iq): 50uA
USB1 = USB-B01: Connector Type:Type-B Standard:USB 2.0 Gender:Mother Mounting Style:Bend-in Number of Contacts:4P Number of Ports:1 Current Rating - Power (Max):- Operating Temperature Range:- Operating Temperature Range:-; LCSC Part Name: Type-B 母 弯插; Supplier Part: C498173; Manufacturer: SOFNG(硕方); Supplier Footprint: 插件; JLCPCB Part Class: Extended Part; Datasheet: https://atta.szlcsc.com/upload/public/pdf/source/20241205/E91F6EB45793D6E28E6049372FBBC2AE.pdf; Supplier: LCSC; Connector Type: Type-B; Standard: USB 2.0; Gender: Mother; Mounting Style: Bend-in; Number of Contacts: 4P; Number of Ports: 1

## Nets
3V3: C7.1 C8.2 C16.2 C17.2 CN2.2 R2.2 R4.2 R5.1 R13.1 R14.1 R19.2 R29.2 U1.2(3V3) U3.2(Out) U3.4(TAB) U6.8(VCC)
+5V: C3.1 C4.2 C5.1 C6.2 CN5.1 D1.2 U2.2(Out) U2.4(TAB) U3.3(In) U8.16(VCC)
GND: 4.3(E) 5.3(E) 6.3(E) 7.3(E) BOOT1.1 C1.1 C2.2 C3.2 C4.1 C5.2 C6.1 C7.2 C8.1 C9.1 C10.1 C14.2 C16.1 C17.1 C18.1 CN2.5 CN5.3 CN6.2 CN7.2 D3.1 D4.1 D5.1 D6.1(-) D7.1(-) D8.1(-) D9.1(-) D10.1(-) EN1.1 K1.4 K2.4 K3.4 K4.4 Q2.3(S) R17.2 R21.1 R23.1 R31.1 U1.1(GND) U1.15(GND) U1.38(GND) U1.39(EP) U2.1(GND) U3.1(GND) U6.5(GND) U7.2 U7.8 U8.1(GND) U11.4(VCC-) USB1.4(GND) USB1.5(GND) USB1.6(GND)
AC_DAC1: K4.1 R20.2 R24.2 U11.1(OUT1)
AC_DAC1_D25: K3.2 U1.10(IO25)
AC_DAC2: K4.2 R22.2 U5.7(OUT2)
AC_DAC2_D26: R26.1 U1.11(IO26)
AC_DAC2_RAW: C14.1 K3.1 R26.2
AC_DAC_OUT: CN6.1 K4.5 K4.6
AC_DAC_RAW: K3.5 K3.6 U5.5(IN2+) U11.3(IN1+)
AC_DACSC_D27: R27.1 U1.12(IO27)
AC_DACSC_RELAY: 4.2(C) 6.2(C) 7.2(C) C1.2 C2.1 D3.2 D4.2 D5.2 F1.2 K1.1 K1.3 K2.2 K2.3 K3.3 K4.3 U2.3(In) U11.8(VCC+)
AC_DACVL_D14: R28.1 U1.13(IO14)
AC_ENC_D32: 5.2(C) R19.1 U1.8(IO32)
AC_ENC_IN: CN5.2 R18.1
D12: U1.14(IO12)
D22: U1.36(IO22)
D33: U1.9(IO33)
D+: U8.5(D+) USB1.3(D+)
D-: U8.6(D-) USB1.2(D-)
DC_ENCA_D34: CN2.3 R13.2 U1.6(IO34)
DC_ENCB_D35: CN2.4 R14.2 U1.7(IO35)
DC_LOAD_-: K1.2 K2.1 Q2.2(D)
DC_MTR_+: CN2.1 K1.5 K1.6
DC_MTR_-: CN2.6 K2.5 K2.6
DC_POL_D23: R15.1 U1.37(IO23)
DC_PWM_D13: R16.2 U1.16(IO13)
DTR: 2.3(E) R8.1 U8.13(DTR#)
EN: 1.2(C) R3.2 R4.1 U1.3(EN)
IO0: 2.2(C) R1.2 R2.1 U1.25(IO0)
LED_AC_CONTROL_D5: R33.1 U1.29(IO5)
LED_DC_CONTROL_D18: R32.1 U1.30(IO18)
LED_PID_CONTROL_D19: R35.1 U1.31(IO19)
LED_WIFI_CONTROL_D21: R34.1 U1.33(IO21)
RS485D+: R29.1 R30.2 U6.6(A) U9.3 U10.3
RS485D-: R30.1 R31.2 U6.7(B) U9.2 U10.2
RTS: 1.3(E) R7.2 U8.14(RTS#)
RXD0: R10.1 U1.34(U0RXD)
RXD2: U1.27(IO16) U6.1(RO)
TXD0: R9.1 U1.35(U0TXD)
TXD2: U1.28(IO17) U6.4(DI)
TXDEN2: U1.26(IO4) U6.2(RE#) U6.3(DE)
VN: U1.5(SENSOR_VN)
VP: U1.4(SENSOR_VP)
$2N2343: 2.1(B) R7.1
$2N2345: 1.1(B) R8.2
$2N2362: D8.2(+) R5.2
$2N12086: R9.2 U8.3(RXD)
$2N12091: R10.2 U8.2(TXD)
$2N12471: D9.2(+) R33.2
$2N12474: D6.2(+) R32.2
$2N12626: D10.2(+) R35.2
$2N12629: D7.2(+) R34.2
$2N13929: CN7.1 F1.1
$3N1392: 4.1(B) R15.2
$3N1968: Q2.1(G) R16.1 R17.1
$4N452: 5.1(B) R18.2
$4N1109: R22.1 R25.2
$4N2099: 6.1(B) R27.2
$4N2269: 7.1(B) R28.2
$5N1647: U7.5 U9.1
$5N1652: U7.4 U10.1
Net-(BOOT1-2): BOOT1.2 C9.2 R1.1
Net-(C10-2): C10.2 EN1.2 R3.1
Net-(C18-2): C18.2 U8.4(V3)
Net-(D1-1): D1.1 USB1.1(VBUS)
Net-(R20-1): R20.1 R21.2 R24.1 U11.2(IN1-)
Net-(R23-2): R23.2 R25.1 U5.6(IN2-)

Not connected (* = marked no-connect by the designer): U1 17(SD2) 18(SD3) 19(CMD) 20(CLK) 21(SDO) 22(SDI) 23(IO15) 24(IO2) 32(NC)*; U7 1 3 6 7; U8 7(NC.)* 8(OUT#)* 9(CTS#)* 10(DSR#)* 11(RI#)* 12(DCD#)* 15(R232)*

## Notes on the sheets
sheet 1
- USB
- VOLTAGE REGULATOR
- BOOT & ENABLE
- MCU
- DOWNLOADER
- INDICATOR
sheet 2
- Relay Driver
- DC Motor Conector
- Encoder Pull Up
- PWM Driver
- Direction Control
sheet 3
- 5V to 3.3V Level Converter
- AC Motor Encoder & DAC Connector
- PWM TO ANALOG
- DAC RELAY DRIVER
- 3.3V to 5V & 10 V DAC Converter
sheet 4
- TTL to RS485
- Ethernet connector

# Board ESP32_PLANT BOARD_1
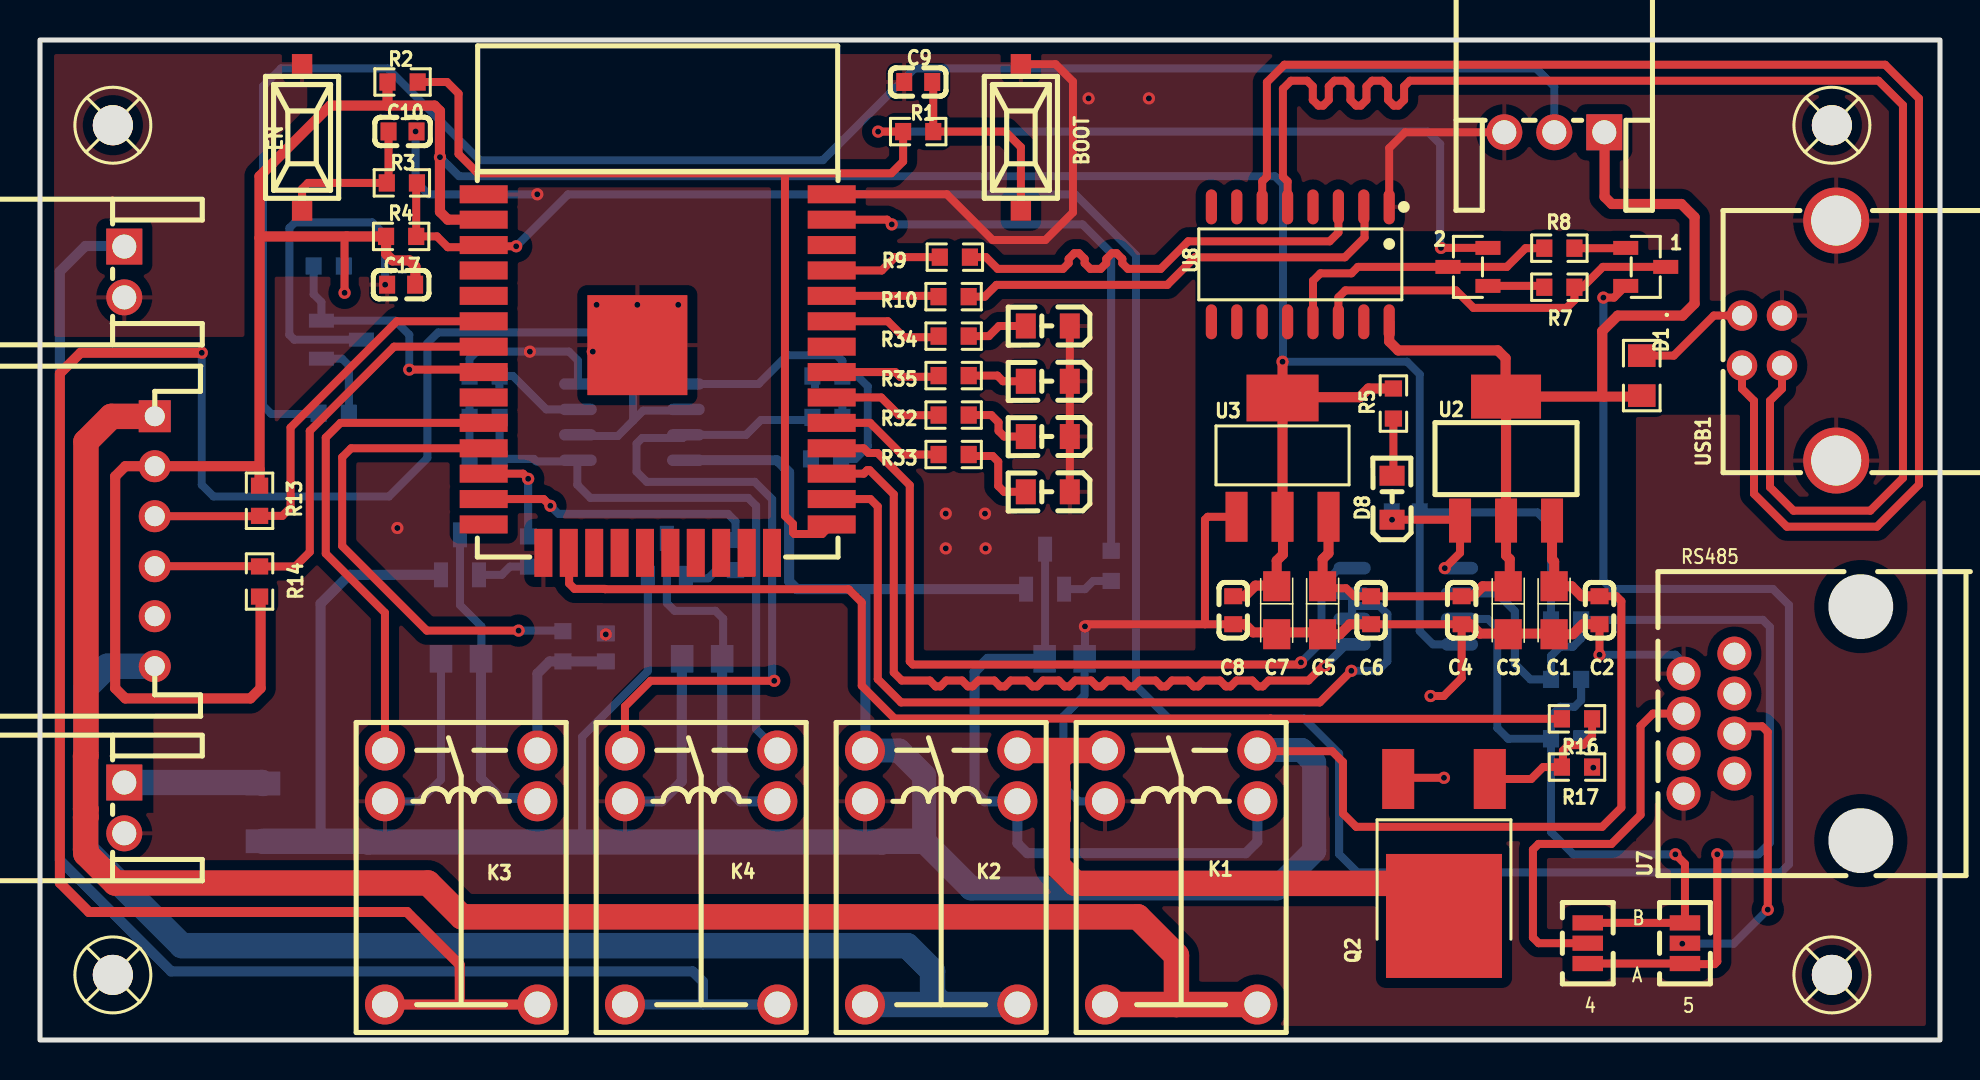
[diagram p4: board, top side]
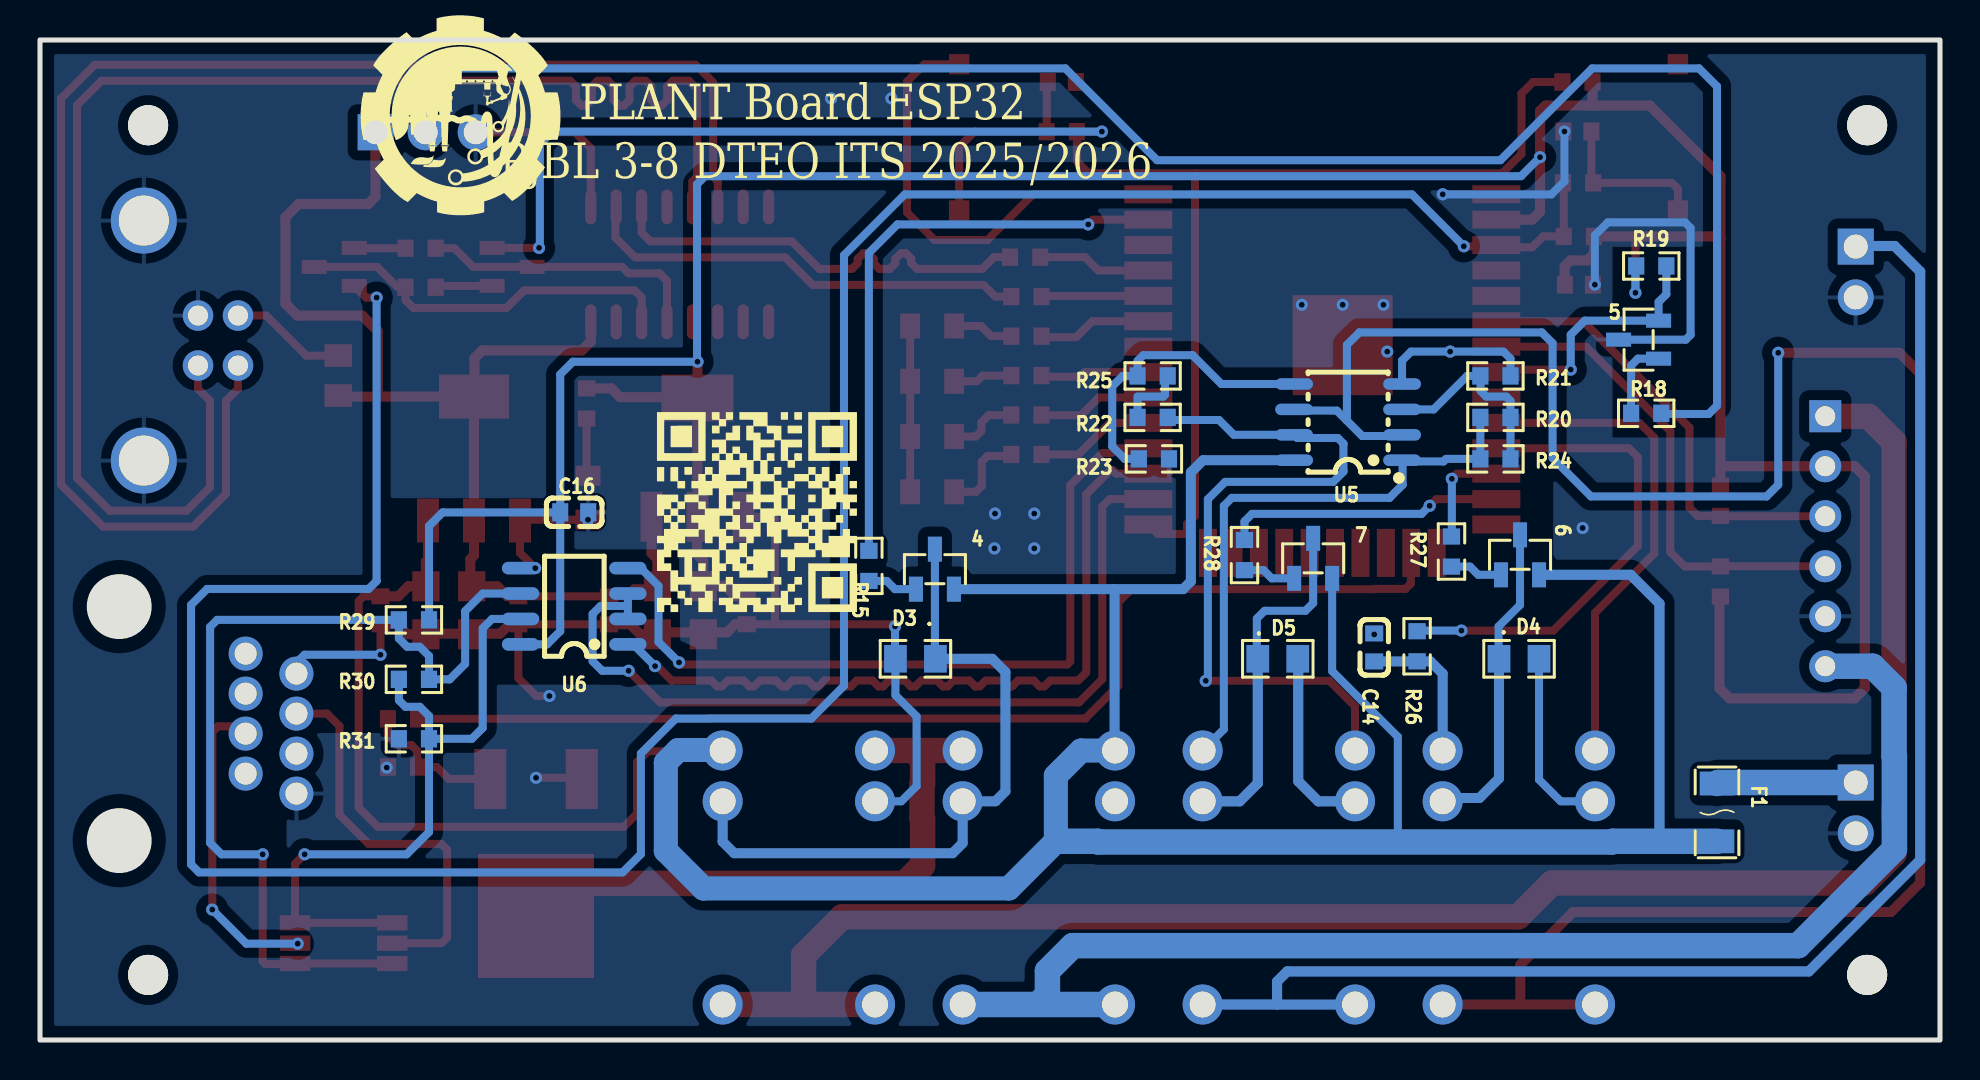
[diagram p5: board, bottom side, seen from below]

Outline 95 x 50 mm; copper layers: Top Layer, Bottom Layer. Coordinates in mm from the lower left corner of the outline.
Outline path: rectangle 0,50 95,0
Stack: Top Layer 0.035mm / Dielectric1 1.51mm FR4 er 4.5 / Bottom Layer 0.035mm

## Design rules (mm)
net $2N12086: DP1
net $2N12091: DP1
net RXD2: DP3
net TXD2: DP3
net D+: DP2
net D-: DP2
template: Custom Config
spacing copperThickness1oz (default): track to track 0.4, other pairs 0.152 to 0.5
spacing copperThickness2oz: track to track 0.203, other pairs 0.152 to 0.3
track width copperThickness1oz (default): min 0.127, default 0.4, max 2.54
track width copperThickness2oz: min 0.203, default 0.254, max 2.54
differential pair differentialPair (default): width min 0.127, default 0.4, max 2.54; gap min 0.4, default 0.4
via viaSize (default): diameter min 0.5, default 0.61, max 10; hole min 0.3, default 0.3, max 6.3
net GND uses gnd
pour e739 uses gnd

## Placement (name value [footprint] x y rotation side)
1  MMBT3904  [SOT-23-3_L2.9-W1.3-P1.90-LS2.4-BR]  80.29 38.66 180 top
2  MMBT3904  [SOT-23-3_L2.9-W1.3-P1.90-LS2.4-BR]  71.4 38.66 0 top
4  MMBT3904  [SOT-23-3_L2.9-W1.3-P1.90-LS2.4-BR]  50.25 23.54 270 bottom
5  MMBT3904  [SOT-23-3_L2.9-W1.3-P1.90-LS2.4-BR]  15.07 35.02 180 bottom
6  MMBT3904  [SOT-23-3_L2.9-W1.3-P1.90-LS2.4-BR]  21 24.26 270 bottom
7  MMBT3904  [SOT-23-3_L2.9-W1.3-P1.90-LS2.4-BR]  31.34 24.08 270 bottom
. D4  -  [D0805]  21.05 19.06 0 bottom
. D5  -  [D0805]  33.11 19.06 0 bottom
BOOT  -  [SMD_PUSH]  49.04 45.13 270 top
C1  100nF  [C0603]  77.98 21.49 90 top
C2  10u  [CASE-A_3216]  75.71 21.49 270 top
C3  10u  [CASE-A_3216]  73.41 21.49 270 top
C4  100nF  [C0603]  71.08 21.49 90 top
C5  10u  [CASE-A_3216]  64.13 21.49 270 top
C6  100nF  [C0603]  66.55 21.49 90 top
C7  10u  [CASE-A_3216]  61.83 21.49 270 top
C8  100nF  [C0603]  59.66 21.49 90 top
C9  1n  [C0603]  43.91 47.9 0 top
C10  1n  [C0603]  18.13 45.43 180 top
C14  100nF  [C0603]  28.29 19.63 90 bottom
C16  100nF  [C0603]  68.29 26.39 0 bottom
C17  100n  [C0603]  18.06 37.77 0 top
CN2  S6B-XH-A(LF)(SN)  [CONN-TH_S6B-XH-A-LF-SN]  5.74 24.94 90 top
CN5  S3B-XH-A-1(LF)(SN)  [CONN-TH_S3B-XH-A-1-LF-SN]  75.72 45.39 0 top
CN6  S2B-XH-A-1(LF)(SN)  [CONN-TH_S2B-XH-A-1-LF-SN]  4.21 38.4 90 top
CN7  S2B-XH-A-1(LF)(SN)  [CONN-TH_S2B-XH-A-1-LF-SN]  4.21 11.6 90 top
D1 .  -  [D0805]  80.09 33.22 270 top
D3 .  -  [D0805]  51.23 19.06 180 bottom
D6  17-21/BHC-XL2M2TY/3T  [LED0805-RD_BLUE]  50.39 30.17 180 top
D7  17-21/BHC-XL2M2TY/3T  [LED0805-RD_BLUE]  50.39 35.7 180 top
D8  17-21/BHC-XL2M2TY/3T  [LED0805-RD_BLUE]  67.6 27.11 90 top
D9  17-21/BHC-XL2M2TY/3T  [LED0805-RD_BLUE]  50.39 27.41 180 top
D10  17-21/BHC-XL2M2TY/3T  [LED0805-RD_BLUE]  50.39 32.94 180 top
EN
  -  [SMD_PUSH]  13.1 45.13 270 top
F1  1206L012WR  [F1206]  11.15 11.38 270 bottom
K1  HK4100F-DC24V-SHG  [RELAY-TH_HK4100F-XXX-XXXX]  57.06 8.12 270 top
K2  HK4100F-DC24V-SHG  [RELAY-TH_HK4100F-XXX-XXXX]  45.06 8.12 270 top
K3  HK4100F-DC24V-SHG  [RELAY-TH_HK4100F-XXX-XXXX]  21.06 8.12 270 top
K4  HK4100F-DC24V-SHG  [RELAY-TH_HK4100F-XXX-XXXX]  33.06 8.12 270 top
Q2  DOD15N10  [TO-252-2_L6.6-W6.1-P4.57-LS9.9-BR-CW]  70.2 9.63 90 top
R1  470  [R0603]  43.91 45.42 180 top
R2  10k  [R0603]  18.13 47.9 180 top
R3  470  [R0603]  18.09 42.86 0 top
R4  10k  [R0603]  18.06 40.18 180 top
R5  1k  [R0603]  67.67 31.82 270 top
R7  10k  [R0603]  75.97 37.64 0 top
R8  10k  [R0603]  75.97 39.59 0 top
R9  1k  [R0603]  45.74 39.14 0 top
R10  1k  [R0603]  45.68 37.17 0 top
R13  1K  [R0603]  10.98 26.96 270 top
R14  1K  [R0603]  10.98 22.92 90 top
R15  1K  [R0603]  53.56 23.71 270 bottom
R16  10  [R0603]  76.85 16.06 180 top
R17  1K  [R0603]  76.85 13.65 0 top
R18  1K  [R0603]  14.69 31.33 0 bottom
R19  1K  [R0603]  14.44 38.7 0 bottom
R20  1K  [R0603]  22.23 31.13 0 bottom
R21  1K  [R0603]  22.23 33.2 0 bottom
R22  1K  [R0603]  39.37 31.13 180 bottom
R23  1K  [R0603]  39.3 29.06 0 bottom
R24  1K  [R0603]  22.23 29.06 0 bottom
R25  1K  [R0603]  39.37 33.2 180 bottom
R26  1K  [R0603]  26.15 19.69 270 bottom
R27  1K  [R0603]  24.43 24.42 270 bottom
R28  1K  [R0603]  34.78 24.25 270 bottom
R29  1k  [R0603]  76.3 21.01 180 bottom
R30  120  [R0603]  76.3 18.03 180 bottom
R31  1k  [R0603]  76.3 15.06 180 bottom
R32  1k  [R0603]  45.68 31.25 0 top
R33  1k  [R0603]  45.68 29.27 0 top
R34  1k  [R0603]  45.68 35.19 0 top
R35  1k  [R0603]  45.68 33.22 0 top
SCREW1  -  [Screw-Hole-M2]  3.64 45.74 0 top
SCREW2  -  [Screw-Hole-M2]  89.59 45.74 0 top
SCREW3  -  [Screw-Hole-M2]  89.59 3.26 0 top
SCREW4  -  [Screw-Hole-M2]  3.64 3.26 0 top
U1  ESP32-WROOM-32D-N8  [WIFIM-SMD_39P-L25.5-W18.0-P1.27]  30.88 33.32 0 top
U2  AMS1117-5.0  [SOT-223_L6.7-W3.5-P2.30-BR]  73.3 29.07 270 top
U3  AMS1117-3.3  [SOT-223-3_L6.5-W3.4-P2.30-LS7.0-BR]  62.13 29.13 270 top
U5  LM358D  [SO-8_L4.9-W3.9-P1.27-LS5.9-BL]  29.59 30.89 90 bottom
U6  MAX485EESA+T(ES)  [SOP-8_L4.9-W3.9-P1.27-LS6.0-BL]  68.29 21.69 90 bottom
U7  CN-网线接口-RJ45  [RJ45-TH_C9900024731]  83.45 15.82 90 top
U8  CH340C  [SOP-16_L10.0-W3.9-P1.27-LS6.0-BL]  63.01 38.78 180 top
U9  solder pad jumper 3 way  [SMD JUMPER 3 PIN]  82.25 4.84 270 top
U10  solder pad jumper 3 way  [SMD JUMPER 3 PIN]  77.39 4.84 270 top
USB1  USB-B01  [USB-B-TH_USB-B01]  87.45 34.97 270 top

## Footprints (pads in the part's own frame, mm; a bottom-side part is the same pattern mirrored in y, then rotated)
C0603
  rect 0.8x0.9 smd: 1(-0.7,0) 2(0.7,0)
CASE-A_3216
  rect 1.5x1.359 smd: 1(-1.2,0) 2(1.2,0)
CONN-TH_S2B-XH-A-1-LF-SN
  rect 1.8x1.8 hole 1.2: 1(1.27,0)
  round 1.8 hole 1.2: 2(-1.27,0)
CONN-TH_S3B-XH-A-1-LF-SN
  rect 1.8x1.8 hole 1.2: 1(2.5,0)
  round 1.8 hole 1.2: 2(0,0) 3(-2.5,0)
CONN-TH_S6B-XH-A-LF-SN
  rect 1.6x1.6 hole 1: 1(6.25,0)
  round 1.6 hole 1: 2(3.75,0) 3(1.25,0) 4(-1.25,0) 5(-3.75,0) 6(-6.25,0)
D0805
  rect 1.133x1.377 smd: 1(-1,0) 2(1,0)
F1206
  rect 1.19x1.728 smd: 1(-1.445,0) 2(1.445,0)
LED0805-RD_BLUE
  rect 1x1.25 smd: 1(-1.1,0) 2(1.1,0)
R0603
  rect 0.806x0.864 smd: 1(-0.753,0) 2(0.753,0)
RELAY-TH_HK4100F-XXX-XXXX
  round 2 hole 1.3: 1(-6.35,3.81) 2(-6.35,-3.81) 3(-3.81,3.81) 4(-3.81,-3.81) 5(6.35,3.81) 6(6.35,-3.81)
RJ45-TH_C9900024731
  round 1.7 hole 1.1: 1(3.5,-1.27) 2(2.5,1.27) 3(1.5,-1.27) 4(0.5,1.27) 5(-0.5,-1.27) 6(-1.5,1.27) 7(-2.5,-1.27) 8(-3.5,1.27)
Screw-Hole-M2
  round 2 hole 2: 1(0,0)
SMD JUMPER 3 PIN
  rect 0.762x1.524 smd: 1(0,0) 2(-1.016,0) 3(1.016,0)
SMD_PUSH
  rect 1.016x1.016 smd: 1(-3.658,0) 2(3.658,0)
SO-8_L4.9-W3.9-P1.27-LS5.9-BL
  oval 0.574x1.888 smd: 1(-1.905,-2.699) 2(-0.635,-2.699) 3(0.635,-2.699) 4(1.905,-2.699) 5(1.905,2.699) 6(0.635,2.699) 7(-0.635,2.699) 8(-1.905,2.699)
SOP-8_L4.9-W3.9-P1.27-LS6.0-BL
  oval 0.63x1.865 smd: 1(-1.905,-2.683) 2(-0.635,-2.683) 3(0.635,-2.683) 4(1.905,-2.683) 5(1.905,2.683) 6(0.635,2.683) 7(-0.635,2.683) 8(-1.905,2.683)
SOP-16_L10.0-W3.9-P1.27-LS6.0-BL
  oval 0.56x1.745 smd: 1(-4.445,-2.873) 2(-3.175,-2.873) 3(-1.905,-2.873) 4(-0.635,-2.873) 5(0.635,-2.873) 6(1.905,-2.873) 7(3.175,-2.873) 8(4.445,-2.873) 9(4.445,2.873) 10(3.175,2.873) 11(1.905,2.873) 12(0.635,2.873) 13(-0.635,2.873) 14(-1.905,2.873) 15(-3.175,2.873) 16(-4.445,2.873)
SOT-23-3_L2.9-W1.3-P1.90-LS2.4-BR
  rect 1.25x0.7 smd: 1(1,-0.95) 2(1,0.95) 3(-1,0)
SOT-223-3_L6.5-W3.4-P2.30-LS7.0-BR
  rect 2.5x1.1 smd: 1(2.97,-2.3) 2(2.97,0) 3(2.97,2.3)
  rect 2.34x3.6 smd: 4(-2.97,0)
SOT-223_L6.7-W3.5-P2.30-BR
  rect 2.2x1.1 smd: 1(3.099,-2.3) 2(3.099,0) 3(3.099,2.3)
  rect 2.2x3.5 smd: 4(-3.099,0)
TO-252-2_L6.6-W6.1-P4.57-LS9.9-BR-CW
  rect 3x1.6 smd: 1(3.424,-2.29) 3(3.424,2.29)
  rect 6.2x5.8 smd: 2(-3.424,0)
USB-B-TH_USB-B01
  round 1.524 hole 1: 1(-1.25,-2.355) 2(1.25,-2.355) 3(1.25,-0.355) 4(-1.25,-0.355)
  round 3.3 hole 2.5: 5(-6,2.355) 6(6,2.355)
WIFIM-SMD_39P-L25.5-W18.0-P1.27
  rect 2.4x0.9 smd: 1(-8.7,8.965) 2(-8.7,7.695) 3(-8.7,6.425) 4(-8.7,5.155) 5(-8.7,3.885) 6(-8.7,2.615) 7(-8.7,1.345) 8(-8.7,0.075) 9(-8.7,-1.195) 10(-8.7,-2.465) 11(-8.7,-3.735) 12(-8.7,-5.005) 13(-8.7,-6.275) 14(-8.7,-7.545) 25(8.7,-7.545) 26(8.7,-6.275) 27(8.7,-5.005) 28(8.7,-3.735) 29(8.7,-2.465) 30(8.7,-1.195) 31(8.7,0.075) 32(8.7,1.345) 33(8.7,2.615) 34(8.7,3.885) 35(8.7,5.155) 36(8.7,6.425) 37(8.7,7.695) 38(8.7,8.965)
  rect 0.9x2.4 smd: 15(-5.715,-8.965) 16(-4.445,-8.965) 17(-3.175,-8.965) 18(-1.905,-8.965) 19(-0.635,-8.965) 20(0.635,-8.965) 21(1.905,-8.965) 22(3.175,-8.965) 23(4.445,-8.965) 24(5.715,-8.965)
  rect 5x5 smd: 39(-1.017,1.422)

## Nets
3V3: C7.1 C8.2 C16.2 C17.2 CN2.2 R2.2 R4.2 R5.1 R13.1 R14.1 R19.2 R29.2 U1.2 U3.2 U3.4 U6.8
+5V: C3.1 C4.2 C5.1 C6.2 CN5.1 D1 ..2 U2.2 U2.4 U3.3 U8.16
GND: 5.3 . D4.1 . D5.1 BOOT.1 C1.1 C2.2 C3.2 C4.1 C5.2 C6.1 C7.2 C8.1 C9.1 C10.1 C14.2 C16.1 C17.1 CN2.5 CN5.3 CN6.2 CN7.2 D3 ..1 D6.1 D7.1 D8.1 D9.1 D10.1 EN
.1 K1.4 K2.4 K3.4 K4.4 Q2.3 R17.2 R21.1 R23.1 R31.1 U1.1 U1.15 U1.38 U1.39 U2.1 U3.1 U5.4 U6.5 U7.2 U7.8 U8.1 USB1.4 USB1.5 USB1.6
AC_DAC1: K4.1 R20.2 R24.2 U5.1
AC_DAC1_D25: K3.2 U1.10
AC_DAC2: K4.2 R22.2 U5.7
AC_DAC2_D25: R26.1 U1.11
AC_DAC2_RAW: C14.1 K3.1 R26.2
AC_DAC_OUT: CN6.1 K4.5 K4.6
AC_DAC_RAW: K3.5 K3.6 U5.2 U5.6
AC_DACSC_D24: R27.1 U1.12
AC_DACSC_RELAY: 6.3 . D4.2 K3.3
AC_DACVL_D14: R28.1 U1.13
AC_DACVL_RELAY: 7.3 . D5.2 K4.3
AC_ENC_D32: 5.2 R19.1 U1.8
AC_ENC_IN: CN5.2 R18.1
D12: U1.14
D22: U1.36
D33: U1.9
D+: U8.5 USB1.3
D-: U8.6 USB1.2
DC_ENCA_D34: CN2.3 R13.2 U1.6
DC_ENCB_D35: CN2.4 R14.2 U1.7
DC_LOAD_+: 4.2 6.2 7.2 C1.2 C2.1 F1.2 K1.1 K2.2 U2.3 U5.8
DC_LOAD_-: K1.2 K2.1 Q2.2
DC_MTR_+: CN2.1 K1.5 K1.6
DC_MTR_-: CN2.6 K2.5 K2.6
DC_POL_D16: R15.1 U1.37
DC_POL_RELAY: 4.3 D3 ..2 K1.3 K2.3
DC_PWM_D13: R16.2 U1.16
DTR: 2.3 R8.1 U8.13
EN: 1.2 R3.2 R4.1 U1.3
IO0: 2.2 R1.2 R2.1 U1.25
LED_AC_CONTROL_D5: R33.1 U1.29
LED_DC_CONTROL_D18: R32.1 U1.30
LED_PID_CONTROL_D19: R35.1 U1.31
LED_WIFI_CONTROL_D21: R34.1 U1.33
RS485D+: R29.1 R30.2 U6.6 U9.3 U10.3
RS485D-: R30.1 R31.2 U6.7 U9.2 U10.2
RTS: 1.3 R7.2 U8.14
RXD0: R10.1 U1.34
RXD2: U1.27 U6.1
TXD0: R9.1 U1.35
TXD2: U1.28 U6.4
TXDEN2: U1.26 U6.2 U6.3
VN: U1.5
VP: U1.4
$2N2343: 2.1 R7.1
$2N2345: 1.1 R8.2
$2N2351: C10.2 EN
.2 R3.1
$2N2352: BOOT.2 C9.2 R1.1
$2N2362: D8.2 R5.2
$2N2982: D1 ..1 USB1.1
$2N12086: R9.2 U8.3
$2N12091: R10.2 U8.2
$2N12471: D9.2 R33.2
$2N12474: D6.2 R32.2
$2N12626: D10.2 R35.2
$2N12629: D7.2 R34.2
$2N13929: CN7.1 F1.1
$3N1392: 4.1 R15.2
$3N1968: Q2.1 R16.1 R17.1
$4N452: 5.1 R18.2
$4N750: R20.1 R21.2 R24.1 U5.3
$4N880: R23.2 R25.1 U5.5
$4N1109: R22.1 R25.2
$4N2099: 6.1 R27.2
$4N2269: 7.1 R28.2
$5N1647: U7.5 U9.1
$5N1652: U7.4 U10.1

Pads without a net: SCREW1 1; SCREW2 1; SCREW3 1; SCREW4 1; U1 17 18 19 20 21 22 23 24 32; U7 1 3 6 7; U8 4 7 8 9 10 11 12 15

## Via types
v1: diameter 0.61, hole 0.3, Top Layer to Bottom Layer, 44 vias

## Routing (per net, layer and track width the routed paths; a pad name or vN(x,y) marks a point on that pad's centre or on a via; arc(x,y) is an arc through that point)
3V3: length 184
  Top Layer w0.4: v1(15.23,37.36) 15.23,40.08 15.33,40.18
  Top Layer w0.5: C8.2 60.24,22.19 60.77,22.72 61.8,22.72 C7.1 61.83,23.97 62.15,24.28 62.15,26.14 U3.2 ; U3.4 v1(62.13,33.91)
  Top Layer w0.508: C17.2 18.77,37.78 18.77,38.68 18.47,38.98 17.63,38.98 17.3,39.31 R4.2 11.05,40.18 10.98,40.1 ; 10.98,40.1 10.98,43.19 14.51,46.72 17.38,46.72 ; 10.98,40.1 10.98,28.53 ; 10.98,28.53 10.82,28.69 CN2.2 4.27,28.69 3.76,28.18 3.76,17.59 4.27,17.08 10.52,17.08 11.03,17.59 11.03,22.12 R14.1 ; 10.98,28.53 R13.1 ; U3.2 U3.4 62.17,32.14 65.99,32.14 66.42,32.58 R5.1 ; 17.38,46.72 19.73,46.72 20,46.45 v1(20,44.14) 20,41.41 20.39,41.02 22.18,41.02 ; 17.38,46.72 R2.2
  Bottom Layer w0.4: v1(15.23,37.36) 15.23,38.66 R19.2 ; R29.2 75.55,25.7 74.87,26.38 69,26.38 C16.2 ; U6.8 69.65,19.78 68.99,20.44 C16.2 ; C16.2 68.99,33.28 68.35,33.91 v1(62.13,33.91) 62.15,33.94 62.15,42.79 61.75,43.19 20.95,43.19 v1(20,44.14)
+5V: length 59.6
  Top Layer w0.4: C5.1 64.23,22.59 65.3,22.59 65.7,22.19 C6.2 C4.2 ; 80.03,32.28 80.09,32.34
  Top Layer w0.5: C5.1 64.13,24.04 64.43,24.34 64.43,26.16 ; 78.2,32.17 79.92,32.17 ; C4.2 71.64,22.19 72.14,22.69 C3.1 73.49,22.77 73.49,24.04 73.3,24.23 U2.2
  Top Layer w0.508: U2.4 78.2,32.17 78.11,32.26 78.11,35.44 78.89,36.22 82.13,36.22 82.73,36.82 82.73,41.14 82.07,41.8 78.59,41.8 78.23,42.16 78.23,45.37 CN5.1 ; U2.4 73.28,32.19 73.28,34.09 72.89,34.48 67.91,34.48 67.46,34.93 67.46,35.91 ; U2.4 U2.2
GND: length 156.2
  Top Layer w0.4: 39.58,42.29 45.34,42.29 47.63,40 50.27,40 51.65,41.38 51.65,47.92 50.78,48.79 BOOT.1 ; v1(70.2,13.11) 67.97,13.11 Q2.3 ; D9.1 D6.1 D10.1 D7.1 ; v1(52.25,20.68) 52.36,20.79 58.25,20.79 ; v1(77.98,19.26) C1.1 ; C6.1 C4.1 71.08,18.09 70.19,17.2 v1(69.53,17.2) ; 58.25,20.79 58.25,26.02 58.39,26.16 U3.1 ; 58.25,20.79 C8.1 ; 67.46,41.65 67.46,44.59 68.25,45.39 CN5.3 ; v1(70.24,23.59) 71,24.36 U2.1 70.96,26.01 v1(67.6,26.01)
  Top Layer w0.5: C1.1 77.14,20.79 76.64,20.29 C2.2 75.67,20.32 71.99,20.32 71.52,20.79 C4.1 ; C8.1 60.24,20.79 60.65,20.38 64.04,20.38 C5.2 65,20.29 65.5,20.79 C6.1
  Bottom Layer w0.4: v1(52.25,20.68) 52.25,19.08 D3 ..1 52.23,17.24 51.17,16.18 51.17,12.7 51.93,11.94 K1.4 ; 5.3 12.71,35.02 12.47,35.26 12.47,40.6 12.75,40.88 16.61,40.88 17.26,40.23 v1(17.26,37.77) ; v1(77.98,19.26) 81.78,19.26 82.18,18.86 U7.2 ; R21.1 21.48,34.07 21.83,34.42 v1(24.49,34.42) 26.45,34.42 26.9,33.97 U5.4 ; K3.4 18.96,11.94 20.05,13.02 . D4.1 ; v1(18.78,45.43) 18.78,42.93 19.43,42.28 24.86,42.28 v1(24.86,42.29)
  Bottom Layer w0.508: . D5.1 32.09,19.04 32.09,12.94 31.08,11.94 K4.4
  vias: v1(17.87,25.6) v1(27.64,34.42) v1(27.83,36.76) v1(28.29,20.28) v1(29.87,36.76) v1(31.91,36.76) v1(45.29,26.32) v1(45.29,24.58) v1(47.25,26.32) v1(47.28,24.58) v1(52.43,47.08) v1(55.44,47.08) v1(77.66,13.62)
AC_DAC1: length 29.3
  Bottom Layer w0.4: 26.87,28.93 26.87,28.96 U5.1 ; 26.87,28.93 24.82,28.93 24.69,29.06 22.98,29.06 22.98,31.13 ; 26.87,28.93 26.87,27.76 27.52,27.11 35.41,27.11 35.81,26.71 35.81,15.54 36.87,14.48
AC_DAC1_D25: length 25.1
  Top Layer w0.4: 17.25,14.48 17.25,21.36 14.29,24.32 14.29,30.12 15.02,30.86 22.18,30.86
AC_DAC2: length 37.4
  Top Layer w0.4: v1(36.71,17.96) 30.53,17.96 29.25,16.68 29.25,14.48
  Bottom Layer w0.4: R22.2 38.48,31 36.05,31 35.31,30.26 U5.7 32.13,30.1 30.11,30.1 29.83,29.82 29.83,28.42 30.34,27.91 35.74,27.91 36.61,27.04 36.61,18.06 v1(36.71,17.96)
AC_DAC2_D25: length 24.5
  Top Layer w0.4: 22.18,29.59 15.55,29.59 15.11,29.14 15.11,24.7 19.34,20.47 v1(23.93,20.47)
  Bottom Layer w0.4: v1(23.93,20.47) 26.11,20.47 R26.1
AC_DAC2_RAW: length 7.5
  Bottom Layer w0.5: C14.1 25.48,18.93 24.87,18.32 24.87,14.48
AC_DAC_OUT: length 76.6
  Bottom Layer w0.5: K4.6 33.15,1.78
  Bottom Layer w0.508: CN6.1 4.19,39.7 2.27,39.7 0.99,38.42 0.99,9 6.56,3.43 32.64,3.43 33.15,2.92 33.15,1.78 K4.5
AC_DAC_RAW: length 109.3
  Top Layer w0.5: K3.6 K3.5 ; v1(8.09,34.36) 2.03,34.36 0.99,33.33 0.99,7.85 2.45,6.4 18.35,6.4 20.99,3.76 20.99,1.9
  Bottom Layer w0.4: 29.65,30.97 30.16,31.47 32.29,31.47 ; 29.65,30.97 28.89,30.2 26.9,30.2 ; 29.65,30.97 29.65,34.75 29.03,35.38 19.91,35.38 19.37,34.84 19.37,29.1 17.45,27.18 8.67,27.18 8.09,27.76 v1(8.09,34.36)
AC_DACSC_D24: length 5.2
  Top Layer w0.4: 22.18,28.32 24.15,28.32 v1(24.41,28.06)
  Bottom Layer w0.4: v1(24.41,28.06) 24.41,25.19 R27.1
AC_DACSC_RELAY: length 15.9
  Bottom Layer w0.4: . D4.2 22.07,19.08 22.07,20.68 21,21.75 6.3
  Bottom Layer w0.5: . D4.2 22.05,13.08 23.03,12.1 24.7,12.1 K3.3
AC_DACVL_D14: length 14
  Top Layer w0.4: 22.18,27.05 25.18,27.05 v1(25.52,26.71)
  Bottom Layer w0.4: v1(25.52,26.71) 25.92,26.31 34.4,26.31 34.78,25.93 R28.1
AC_DACVL_RELAY: length 17.8
  Bottom Layer w0.4: . D5.2 34.16,19.11 34.16,21.07 33.77,21.46 31.73,21.46 31.34,21.85 7.3
  Bottom Layer w0.508: . D5.2 34.11,12.84 35.01,11.94 K4.3
AC_ENC_D32: length 13.1
  Top Layer w0.4: 22.18,33.4 22.06,33.52 v1(18.46,33.52)
  Bottom Layer w0.4: v1(18.46,33.52) 18.46,35.27 17.76,35.97 5.2 14.07,36.9 13.68,37.29 R19.1
AC_ENC_IN: length 90.3
  Bottom Layer w0.4: R18.1 13.9,31.3 11.57,31.3 11.15,31.72 11.15,47.68 12.05,48.58 17.39,48.58 21.98,43.99 39.15,43.99 43.73,48.58 74.81,48.58 75.72,47.67 CN5.2
D+: length 75.9
  Top Layer w0.4: USB1.3 87.1,32.56 86.5,31.96 86.5,27.64 87.67,26.47 91.51,26.47 93.15,28.1 93.15,46.74 91.93,47.96 68.49,47.96 68.2,47.68 68.2,47 67.92,46.72 67.69,46.72 67.41,47 67.41,47.68 67.12,47.96 66.6,47.96 66.32,47.68 66.32,47 66.04,46.72 65.81,46.72 65.52,47 65.52,47.68 65.24,47.96 64.72,47.96 64.44,47.68 64.44,47 64.16,46.72 63.92,46.72 63.64,47 63.64,47.68 63.36,47.96 62.55,47.96 62.15,47.56 62.15,43.16 62.38,42.93 U8.5
D-: length 75.8
  Top Layer w0.4: USB1.2 85.1,32.56 85.7,31.96 85.7,27.31 87.34,25.67 91.85,25.67 93.95,27.77 93.95,47.07 92.26,48.76 62.22,48.76 61.34,47.89 61.34,43.16 61.11,42.93 U8.6
DC_ENCA_D34: length 22.8
  Top Layer w0.4: 22.18,35.94 17.84,35.94 12.53,30.62 12.53,26.62 12.12,26.21 R13.2 10.96,26.19 CN2.3
DC_ENCB_D35: length 24.5
  Top Layer w0.4: 22.18,34.67 17.7,34.67 13.49,30.45 13.49,24.4 12.77,23.68 R14.2 10.97,23.69 CN2.4
DC_LOAD_+: length 171.4
  Top Layer w0.4: C1.2 78.82,22.19 79.07,21.94 79.07,11.62 78.11,10.66 65.81,10.66 65.15,11.32 65.15,13.9 64.61,14.44 60.9,14.44 60.87,14.48
  Top Layer w0.5: C1.2 77.08,22.19 76.58,22.69 C2.1 75.71,22.69 75.71,23.92 75.6,24.03 U2.3
  Bottom Layer w0.4: 27.11,10.18 27.11,15.16 30.39,18.44 7.2
  Bottom Layer w0.5: 41.27,22.54 41.27,14.5 41.25,14.48 ; 41.27,22.54 37.85,22.54 37.46,22.93 37.46,28.38 36.85,28.99 U5.8 ; 41.27,22.54 4.2
  Bottom Layer w0.508: 13.89,9.94 14.03,10.08 14.03,21.82 15.47,23.26 20.05,23.26
  Bottom Layer w1.2: 41.25,14.48 42.94,14.48 44.21,13.21 44.21,9.93 46.56,7.58 61.82,7.58 63.71,9.46 63.71,13.88 63.08,14.5 60.89,14.5 60.87,14.48
  Bottom Layer w1.27: F1.2 16.37,9.94 16.41,9.9 42.09,9.9 42.13,9.94 44.2,9.94 44.21,9.93
DC_LOAD_-: length 30.4
  Top Layer w1.27: 48.87,14.48 53.25,14.48 ; 51.11,14.26 50.87,14.02 50.87,12.81 50.9,12.78 50.9,11.09 50.87,11.06 50.87,8.73 51.77,7.83 68.57,7.83 Q2.2
DC_MTR_+: length 91.3
  Top Layer w1.27: 56.82,1.78 56.82,4.23 54.89,6.16 21.09,6.16 19.4,7.85 3.76,7.85 2.3,9.31 2.3,9.52 2.28,9.53 2.28,11.14 2.3,11.15 2.3,11.53 2.28,11.55 2.28,14.2 2.3,14.22 2.3,29.91 3.57,31.18 5.73,31.18 CN2.1 ; 56.82,1.78 K1.6 ; 56.82,1.78 K1.5
DC_MTR_-: length 66
  Bottom Layer w1.27: CN2.6 3.37,18.69 2.3,17.62 2.3,14.22 2.28,14.2 2.28,9.53 7.09,4.72 43.36,4.72 44.63,3.45 44.63,2.26 44.87,2.02 ; K2.5 K2.6
DC_POL_D16: length 29.6
  Top Layer w0.4: 39.58,41.02 42.35,41.02 v1(42.59,40.78)
  Bottom Layer w0.4: R15.1 53.56,39.35 52.13,40.78 v1(42.59,40.78)
DC_POL_RELAY: length 34.1
  Bottom Layer w0.4: D3 ..2 50.25,19.09 4.3
  Bottom Layer w0.5: D3 ..2 47.39,19.06 46.73,18.4 46.73,12.44 47.23,11.94 K2.3 48.87,9.84 49.37,9.34 60.29,9.34 60.87,9.92 K1.3
DC_PWM_D13: length 56.4
  Top Layer w0.4: U1.16 26.46,24.34 26.46,22.82 26.73,22.56 28.24,22.56 28.25,22.54 40.43,22.54 41.09,21.88 41.09,17.71 42.73,16.08 61.53,16.08 61.55,16.06 R16.2
DTR: length 14.3
  Top Layer w0.4: R8.1 74.28,39.59 73.34,38.66 2.3 65.9,38.66 65.57,38.33 64.02,38.33 63.65,37.96 U8.13
EN: length 140.7
  Top Layer w0.4: v1(78.17,37.12) 78.7,37.12 1.2 ; 18.81,42.85 R4.1 19.85,40.18 20.39,39.64 22.08,39.64 22.18,39.75 22.24,39.69 v1(23.81,39.69)
  Bottom Layer w0.4: v1(23.81,39.69) 26.4,42.28 51.76,42.28 54.8,39.24 54.8,17.71 56.43,16.08 63.21,16.08 64.96,14.32 64.96,9.29 65.87,8.38 87.05,8.38 87.45,8.78 87.45,21.75 86.65,22.55 78.57,22.55 78.17,22.95 v1(78.17,37.12)
IO0: length 87.1
  Top Layer w0.4: 2.2 v1(70.05,39.61) ; 37.25,43.34 21.89,43.34 20.93,44.3 20.93,47.32 20.35,47.9 18.88,47.9 ; 37.25,43.34 42.56,43.34 43.16,43.93 R1.2 v1(41.91,45.42) ; 37.25,43.34 37.25,26.21 37.65,25.8 37.65,25.38 37.73,25.3 39.11,25.3 39.58,25.78
  Bottom Layer w0.4: v1(70.05,39.61) 70.01,39.65 70.01,44.8 69.39,45.42 v1(41.91,45.42)
LED_AC_CONTROL_D5: length 6
  Top Layer w0.4: R33.1 43.09,29.27 41.5,30.86 39.58,30.86
LED_DC_CONTROL_D18: length 5.7
  Top Layer w0.4: 39.58,32.13 42.06,32.13 42.95,31.24 44.92,31.24 R32.1
LED_PID_CONTROL_D19: length 5.5
  Top Layer w0.4: R35.1 44.87,33.16 43,33.16 42.77,33.4 39.58,33.4
LED_WIFI_CONTROL_D21: length 5.7
  Top Layer w0.4: R34.1 44.87,35.14 43.19,35.14 42.39,35.94 39.58,35.94
RS485D+: length 47
  Top Layer w0.4: v1(83.86,9.29) 83.86,3.93 83.73,3.8 82.28,3.8 U9.3 U10.3
  Bottom Layer w0.4: U6.6 72.87,22.32 73.74,21.45 73.74,18.81 74.51,18.03 R30.2 75.55,19.2 76.01,19.66 76.64,19.66 77.06,20.08 R29.1 86.14,21.01 86.49,20.66 86.49,9.86 85.92,9.29 v1(83.86,9.29)
RS485D-: length 33.8
  Top Layer w0.4: v1(81.77,9.29) 82.25,8.81 U9.2 U10.2
  Bottom Layer w0.4: R31.2 75.55,16.2 76.01,16.66 76.73,16.66 77.06,16.99 R30.1 ; R31.2 73.41,15.06 72.87,15.6 72.87,20.58 72.4,21.05 U6.7 ; R31.2 75.55,10.4 76.66,9.29 v1(81.77,9.29)
RTS: length 19.3
  Top Layer w0.4: U8.14 64.92,37.13 65.27,37.48 70.8,37.48 71.67,36.61 76.34,36.61 76.72,36.99 R7.2 77.13,37.64 78.14,38.66 1.3
RXD0: length 5.4
  Top Layer w0.4: 39.58,37.21 44.89,37.21 R10.1
RXD2: length 39.1
  Top Layer w0.4: 39.58,28.32 41.18,28.32 41.35,28.49 41.48,28.49 42.69,27.28 42.69,18.38 43.09,17.98 44.49,17.98 44.78,17.68 45.02,17.68 45.31,17.98 46.1,17.98 46.4,17.68 46.63,17.68 46.92,17.98 47.71,17.98 48.01,17.68 48.24,17.68 48.54,17.98 49.32,17.98 49.62,17.68 49.85,17.68 50.15,17.98 50.94,17.98 51.23,17.68 51.47,17.68 51.76,17.98 52.55,17.98 52.84,17.68 53.08,17.68 53.37,17.98 54.16,17.98 54.46,17.68 54.69,17.68 54.99,17.98 55.77,17.98 56.07,17.68 56.3,17.68 56.6,17.98 57.39,17.98 57.68,17.68 57.91,17.68 58.21,17.98 59,17.98 59.29,17.68 59.53,17.68 59.82,17.98 60.61,17.98 60.9,17.68 61.14,17.68 61.43,17.98 63.42,17.98 64.14,18.7 v1(64.25,18.7)
  Bottom Layer w0.4: U6.1 65.34,19.78 v1(64.25,18.7)
TXD0: length 5.7
  Top Layer w0.4: R9.1 42.75,39.14 42.09,38.48 39.58,38.48
TXD2: length 39.3
  Top Layer w0.4: v1(63.05,18.88) 62.94,18.78 43.64,18.78 43.49,18.93 43.49,27.74 41.88,29.35 41.42,29.35 41.18,29.59 39.58,29.59
  Bottom Layer w0.4: v1(63.05,18.88) 64.07,19.91 64.07,22.7 64.97,23.59 U6.4
TXDEN2: length 43.5
  Top Layer w0.4: v1(65.57,18.46) 63.99,16.88 43.05,16.88 41.89,18.04 41.89,26.68 41.52,27.05 39.58,27.05
  Bottom Layer w0.4: v1(65.57,18.46) 66.89,18.46 67.37,18.94 67.37,21.3 66.97,21.7 65.66,21.7 65.61,21.75 ; U6.2 65.61,21.75 ; 65.61,21.75 U6.3
$2N2343: length 2.8
  Top Layer w0.4: R7.1 75.15,37.71 2.1
$2N2345: length 2.6
  Top Layer w0.4: R8.2 79.27,39.59 1.1
$2N2351: length 8
  Top Layer w0.4: C10.2 17.43,42.98 17.3,42.85 13.4,42.85 13.1,42.56 EN
.2
$2N2352: length 10.4
  Top Layer w0.4: C9.2 44.66,47.85 R1.1 48.27,45.42 49.04,44.64 BOOT.2
$2N2362: length 2.9
  Top Layer w0.4: R5.2 67.67,28.28 67.6,28.21
$2N2982: length 5.8
  Top Layer w0.4: USB1.1 83.69,36.22 81.69,34.22 D1 ..1
$2N12086: length 22.5
  Top Layer w0.4: U8.3 64.92,40.37 64.48,39.93 57.41,39.93 56.03,38.56 54.4,38.56 54.12,38.84 54.12,39.06 53.83,39.34 53.6,39.34 53.31,39.06 53.31,38.84 53.03,38.56 52.51,38.56 52.23,38.84 52.23,39.06 51.95,39.34 51.72,39.34 51.43,39.06 51.43,38.84 51.15,38.56 47.89,38.56 47.3,39.14 R9.2
$2N12091: length 22.6
  Top Layer w0.4: U8.2 66.23,41.62 66.23,40.12 65.24,39.13 57.74,39.13 56.36,37.76 47.82,37.76 47.24,37.17 R10.2
$2N12471: length 4.3
  Top Layer w0.4: R33.2 46.51,29.2 47.63,29.2 47.91,28.92 47.91,27.7 48.2,27.41 D9.2
$2N12474: length 3.5
  Top Layer w0.4: R32.2 47.56,31.25 47.93,30.88 47.93,30.46 48.21,30.17 D6.2
$2N12626: length 3
  Top Layer w0.4: R35.2 47.87,33.22 48.15,32.94 D10.2
$2N12629: length 3.1
  Top Layer w0.4: R34.2 47.44,35.19 47.95,35.7 D7.2
$2N13929: length 7
  Bottom Layer w1.27: CN7.1 11.1,12.87 F1.1
$3N1392: length 2.5
  Bottom Layer w0.4: 4.1 52.25,22.54 52.66,22.95 R15.2
$3N1968: length 7.3
  Top Layer w0.4: R16.1 77.6,15.2 77.15,14.74 76.43,14.74 76.15,14.46 76.15,13.69 R17.1 75.15,13.65 74.56,13.05 Q2.1
$4N452: length 3.9
  Bottom Layer w0.4: 5.1 15.1,34.07 15.44,33.73 R18.2
$4N750: length 10
  Bottom Layer w0.4: R24.1 R20.1 21.48,31.96 21.69,32.17 22.69,32.17 22.97,32.45 22.97,33.19 22.98,33.2 23.65,33.2 25.32,31.53 U5.3
$4N880: length 15.4
  Bottom Layer w0.4: R23.2 40.76,29.06 41.39,29.68 41.39,32.68 40.87,33.2 R25.1 40.12,33.96 39.84,34.24 37.37,34.24 35.93,32.8 U5.5
$4N1109: length 3.4
  Bottom Layer w0.4: R22.1 40.12,32.17 38.84,32.17 38.75,32.26 38.75,33.07 38.61,33.2 R25.2
$4N2099: length 2.6
  Bottom Layer w0.4: R27.2 23.5,23.67 23.09,23.26 6.1
$4N2269: length 2.7
  Bottom Layer w0.4: 7.1 33.41,23.08 33.82,23.49 R28.2
$5N1647: length 15.8
  Top Layer w0.4: v1(86.39,6.52) 86.39,15.4 86.11,15.68 85.08,15.68 U7.5 ; U9.1 82.28,4.88
  Bottom Layer w0.4: v1(82.11,4.82) 84.68,4.82 v1(86.39,6.52)
$5N1652: length 20.2
  Top Layer w0.4: U10.1 74.93,4.84 74.65,5.12 74.65,9.52 74.93,9.8 78.57,9.8 80.03,11.26 80.03,15.7 80.65,16.32 U7.4

## Copper pours and planes (outline as drawn; the poured copper is in the pictures)
GND on Top Layer: 0,50 95,50 95,0 0,0
GND on Bottom Layer: 0,50 95,50 95,0 0,0

## Text on the board
Bottom Silkscreen Layer: PLANT Board ESP32 / PjBL 3-8 DTEO ITS 2025/2026
Top Silkscreen Layer: 4 | A | B | RS485 | 5
